# EAGLE design RedBoard_Plus (EAGLE 9.5.2)
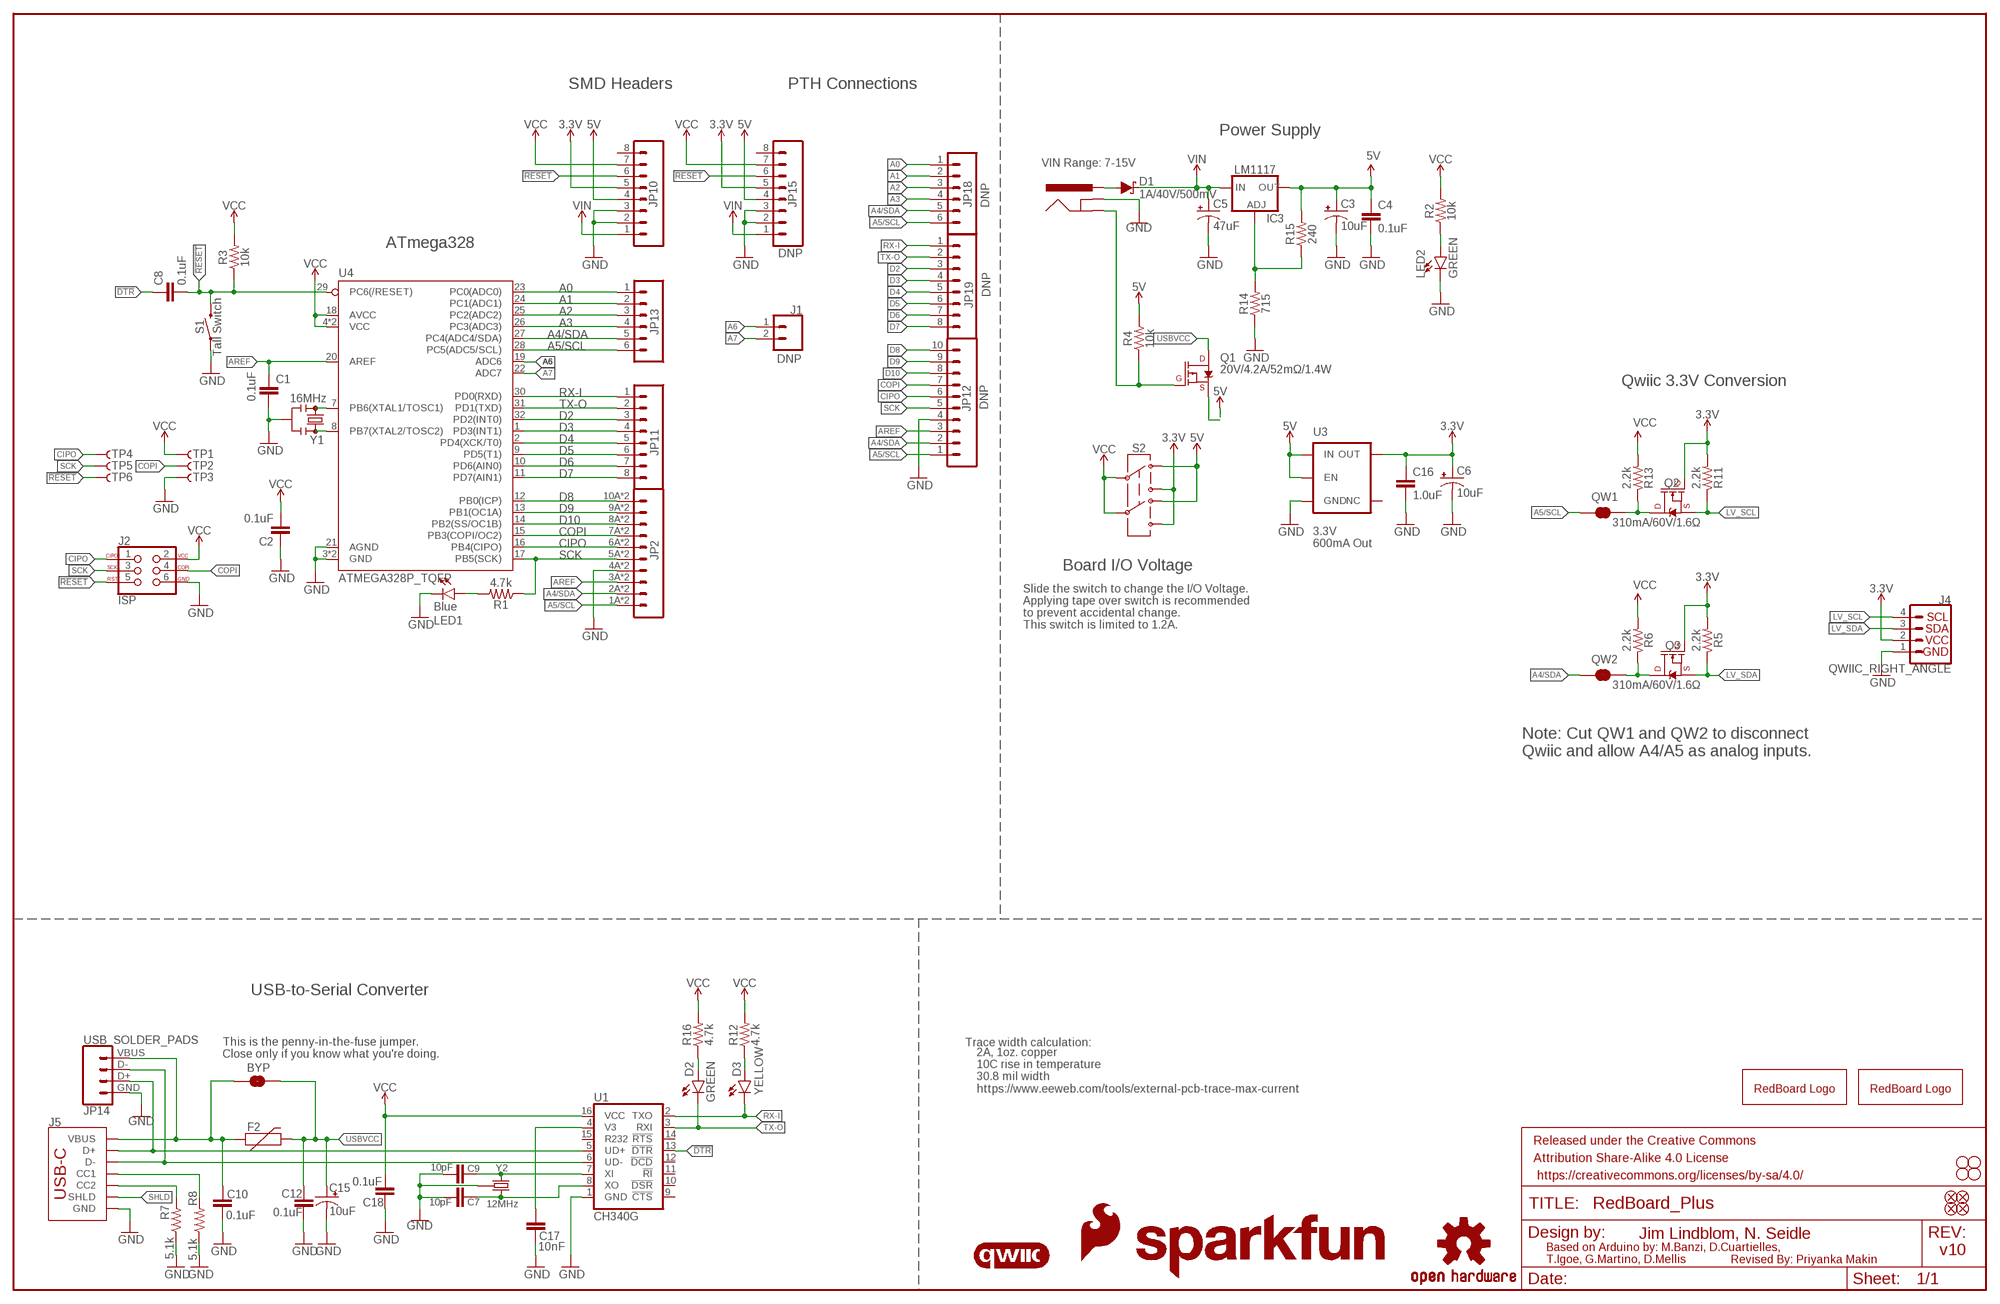
[diagram p0: schematic, sheet 1]

## Parts
BYP  JUMPER-SMT_2_NO_SILK  [SMT-JUMPER_2_NO_SILK]
C1  0.1uF  0.1UF-0603-25V-(+80/-20%)  [0603]
C2  0.1uF  0.1UF-0603-25V-(+80/-20%)  [0603]
C3  10uF  10UF-POLAR-EIA3216-16V-10%(TANT)  [EIA3216]
C4  0.1uF  0.1UF-0603-25V-(+80/-20%)  [0603]
C5  47uF  47UF-POLAR-PANASONIC_D-35V-20%  [PANASONIC_D]
C6  10uF  10UF-POLAR-EIA3216-16V-10%(TANT)  [EIA3216]
C7  10pF  10PF-0603-50V-5%  [0603]
C8  0.1uF  0.1UF-0603-25V-(+80/-20%)  [0603]
C9  10pF  10PF-0603-50V-5%  [0603]
C10  0.1uF  0.1UF-0603-25V-(+80/-20%)  [0603]
C12  0.1uF  0.1UF-0603-25V-(+80/-20%)  [0603]
C15  10uF  10UF-POLAR-EIA3216-16V-10%(TANT)  [EIA3216]
C16  1.0uF  1.0UF-0603-16V-10%  [0603]
C17  10nF  10NF-0603-50V-10%  [0603]
C18  0.1uF  0.1UF-0603-25V-(+80/-20%)  [0603]
D1  1A/40V/500mV  DIODE-SCHOTTKY-SS14  [SMA-DIODE]
D2  GREEN  LED-GREENLILYPAD  [LED-1206]
D3  YELLOW  LED-YELLOW_HIDDENSILK  [LED-1206-HIDDENSILK]
F2  6V/2A  PPTC_6V2A  [1210]
FD1  FIDUCIAL1X2  [FIDUCIAL-1X2]
FD2  FIDUCIAL1X2  [FIDUCIAL-1X2]
FRAME1  FRAME-LEDGER  [CREATIVE_COMMONS]
IC3  LM1117  V_REG_LM1117SOT223  [SOT223]
J1  DNP  CONN_021X02_NO_SILK  [1X02_NO_SILK]
J2  ISP  AVR_SPI_PROG_3X2SMD  [2X3_SMT_POSTS]
J3  5.5x2.1mm Barrel  POWER_JACKSMD  [POWER_JACK_SMD]
J4  QWIIC_RIGHT_ANGLE  QWIIC_CONNECTORJS-1MM  [JST04_1MM_RA]
J5  USB Female Type C Connector  USB_C_2-LAYER_PADS  [USB-C-16P-2LAYER-PADS]
JP1  SFE_LOGO_NAME.1_INCH  [SFE_LOGO_NAME_.1]
JP2  CONN_10SMD_COMBO-FEMALE  [1X10_SMD_COMBINED]
JP3  STAND-OFFTIGHT  [STAND-OFF-TIGHT]
JP4  STAND-OFFTIGHT  [STAND-OFF-TIGHT]
JP5  STAND-OFFTIGHT  [STAND-OFF-TIGHT]
JP6  STAND-OFFTIGHT  [STAND-OFF-TIGHT]
JP7  SFE_LOGO_FLAME.1_INCH  [SFE_LOGO_FLAME_.1]
JP8  FIDUCIAL1X2  [FIDUCIAL-1X2]
JP9  FIDUCIAL1X2  [FIDUCIAL-1X2]
JP10  CONN_08SMD-COMBO-FEMALE  [1X08_SMD_COMBINED]
JP11  JP11  CONN_08SMD-COMBO-FEMALE  [1X08_SMD_COMBINED]
JP12  DNP  CONN_10NO_SILK_PTH_FEMALE  [1X10_NO_SILK]
JP13  CONN_06SMD-STRAIGHT-COMBO-FEMALE  [1X06_SMD_STRAIGHT_COMBO]
JP14  USB_SOLDER_PADS  [USB-SOLDER-PADS]
JP15  DNP  CONN_08NO_SILK_DNP  [1X08_NO_SILK]
JP18  DNP  CONN_06NO_SILK_NO_POP  [1X06_NO_SILK]
JP19  DNP  CONN_08NO_SILK_DNP  [1X08_NO_SILK]
LED1  Blue  LED-BLUE_HIDDENSILK  [LED-1206-HIDDENSILK]
LED2  GREEN  LED-GREENLILYPAD  [LED-1206]
LOGO1  QWIIC_LOGO_5MM  [QWIIC_5MM]
Q1  20V/4.2A/52mΩ/1.4W  MOSFET_PCH-DMG2305UX-7  [SOT23-3]
Q2  310mA/60V/1.6Ω  MOSFET-NCH-2N7002PW  [SOT323]
Q3  310mA/60V/1.6Ω  MOSFET-NCH-2N7002PW  [SOT323]
QW1  JUMPER-SMT_2_NC_TRACE_SILK  [SMT-JUMPER_2_NC_TRACE_SILK]
QW2  JUMPER-SMT_2_NC_TRACE_SILK  [SMT-JUMPER_2_NC_TRACE_SILK]
R1  4.7k  4.7KOHM-0603-1/10W-1%  [0603]
R2  10k  10KOHM-0603-1/10W-1%  [0603]
R3  10k  10KOHM-0603-1/10W-1%  [0603]
R4  10k  10KOHM-0603-1/10W-1%  [0603]
R5  2.2k  2.2KOHM-0603-1/10W-1%  [0603]
R6  2.2k  2.2KOHM-0603-1/10W-1%  [0603]
R7  5.1k  5.1KOHM5.1KOHM-0603-1/10W-1%  [0603]
R8  5.1k  5.1KOHM5.1KOHM-0603-1/10W-1%  [0603]
R11  2.2k  2.2KOHM-0603-1/10W-1%  [0603]
R12  4.7k  4.7KOHM-0603-1/10W-1%  [0603]
R13  2.2k  2.2KOHM-0603-1/10W-1%  [0603]
R14  715  715OHM-0603-1/10W-1%  [0603]
R15  240  240OHM-0603-1/10W-1%  [0603]
R16  4.7k  4.7KOHM-0603-1/10W-1%  [0603]
S1  Tall Switch  MOMENTARY-SWITCH-SPST-SMD-5.2-TALL-REDUNDANT  [TACTILE_SWITCH_SMD_5.2MM]
S2  SWITCH-DPDT-SMD-AYZ0202  [SWITCH_DPDT_SMD_AYZ0202]
TP1  TP-3x5  TEST-POINT3X5  [PAD.03X.05]
TP2  TP-3x5  TEST-POINT3X5  [PAD.03X.05]
TP3  TP-3x5  TEST-POINT3X5  [PAD.03X.05]
TP4  TP-3x5  TEST-POINT3X5  [PAD.03X.05]
TP5  TP-3x5  TEST-POINT3X5  [PAD.03X.05]
TP6  TP-3x5  TEST-POINT3X5  [PAD.03X.05]
U1  CH340G  CH340GSMD  [SO016]
U3  3.3V  V_REG_AP2112K-3.3V  [SOT23-5]
U4  ATMEGA328P_TQFP  [TQFP32-08]
U$1  REDBOARD_LOGO  [REDBOARD_LOGO]
U$3  REDBOARD_LOGO  [REDBOARD_LOGO]
U$16  OSHW-LOGOS  [OSHW-LOGO-S]
Y1  16MHz  RESONATOR-16MHZSMD_3.2X1.3  [RESONATOR-SMD-3.2X1.3]
Y2  12MHz  CRYSTAL-GROUNDEDSMD-3.2X2.5  [CRYSTAL-SMD-3.2X2.5MM]

## Nets
3.3V [power]: C6.+ C16.1 J4.2 JP10.5 JP15.5 Q2.1(G) Q3.1(G) R5.2 R11.2 S2.1 S2.4 U3.5(OUT)
5V [power]: C3.+ C4.1 IC3.2(OUT) IC3.4(OUT) JP10.4 JP15.4 Q1.2(S) R4.2 R15.2 S2.3 S2.6 U3.1(IN) U3.3(EN)
!DTR!: C8.1 U1.13(!DTR)
!RESET: C8.2 J2.5 JP10.6 JP15.6 R3.1 S1.3 S1.4 TP6.P$1 U4.29(PC6(/RESET))
A0: JP13.1 JP18.1 U4.23(PC0(ADC0))
A1: JP13.2 JP18.2 U4.24(PC1(ADC1))
A2: JP13.3 JP18.3 U4.25(PC2(ADC2))
A3: JP13.4 JP18.4 U4.26(PC3(ADC3))
A4/SDA: JP2.2A JP2.2B JP12.2 JP13.5 JP18.5 QW2.1 U4.27(PC4(ADC4/SDA))
A5/SCL: JP2.1A JP2.1B JP12.1 JP13.6 JP18.6 QW1.1 U4.28(PC5(ADC5/SCL))
A6: J1.1 U4.19(ADC6)
A7: J1.2 U4.22(ADC7)
AREF: C1.1 JP2.3A JP2.3B JP12.3 U4.20(AREF)
CC1: J5.A5(CC1) R8.2
CC2: J5.B5(CC2) R7.2
CIPO: J2.1 JP2.6A JP2.6B JP12.6 TP4.P$1 U4.16(PB4(CIPO))
COPI: J2.4 JP2.7A JP2.7B JP12.7 TP2.P$1 U4.15(PB3(COPI/OC2))
D2: JP11.3 JP19.3 U4.32(PD2(INT0))
D3: JP11.4 JP19.4 U4.1(PD3(INT1))
D4: JP11.5 JP19.5 U4.2(PD4(XCK/T0))
D5: JP11.6 JP19.6 U4.9(PD5(T1))
D6: JP11.7 JP19.7 U4.10(PD6(AIN0))
D7: JP11.8 JP19.8 U4.11(PD7(AIN1))
D8: JP2.10A JP2.10B JP12.10 U4.12(PB0(ICP))
D9: JP2.9A JP2.9B JP12.9 U4.13(PB1(OC1A))
D10: JP2.8A JP2.8B JP12.8 U4.14(PB2(SS/OC1B))
D+: J5.A6(D+) J5.B6(D+) JP14.D+ U1.5(UD+)
D-: J5.A7(D-) J5.B7(D-) JP14.D- U1.6(UD-)
GND: C1.2 C2.1 C3.- C4.2 C5.- C6.- C7.2 C9.2 C10.2 C12.2 C15.- C16.2 C17.2 C18.2 J2.6 J3.GND(GNDBREAK) J4.1 J5.GND J5.GND2(GND) JP2.4A JP2.4B JP10.2 JP10.3 JP12.4 JP14.GND JP15.2 JP15.3 LED1.C LED2.C R7.1 R8.1 R14.1 S1.1 S1.2 TP3.P$1 U1.1(GND) U3.2(GND) U4.3(GND) U4.5(GND) U4.21(AGND) Y1.2 Y2.2(GND) Y2.4(GND)
INSERT: J3.P$4(GND) Q1.1(G) R4.1
LV_SCL: J4.4 Q2.2(S) R11.1
LV_SDA: J4.3 Q3.2(S) R5.1
N$1: LED1.A R1.2
N$2: LED2.A R2.1
N$3: U4.7(PB6(XTAL1/TOSC1)) Y1.1
N$4: U4.8(PB7(XTAL2/TOSC2)) Y1.3
N$5: D2.A R16.1
N$6: C17.1 U1.4(V3)
N$7: Q2.3(D) QW1.2 R13.1
N$8: C9.1 U1.7(XI) Y2.1
N$9: D3.A R12.1
N$10: C7.1 U1.8(XO) Y2.3
N$15: IC3.1(ADJ) R14.2 R15.1
N$45: Q3.3(D) QW2.2 R6.1
PWRIN [power]: D1.A J3.VIN0(PWR)
RX-I: D3.C JP11.1 JP19.1 U1.2(TXO) U4.30(PD0(RXD))
SCK: J2.3 JP2.5A JP2.5B JP12.5 R1.1 TP5.P$1 U4.17(PB5(SCK))
SHLD: J5.SHLD1(SHLD) J5.SHLD2(SHLD) J5.SHLD3(SHLD) J5.SHLD4(SHLD)
TX-O: D2.C JP11.2 JP19.2 U1.3(RXI) U4.31(PD1(TXD))
USBVCC [power]: BYP.2 C12.1 C15.+ F2.2 Q1.3(D)
VCC: C2.2 C18.1 J2.2 JP10.7 JP15.7 R2.2 R3.2 R6.2 R12.2 R13.2 R16.2 S2.2 S2.5 TP1.P$1 U1.16(VCC) U4.4(VCC) U4.6(VCC) U4.18(AVCC)
VIN [power]: C5.+ D1.C IC3.3(IN) JP10.1 JP15.1
VUSB [power]: BYP.1 C10.1 F2.1 J5.VBUS1(VBUS) J5.VBUS2(VBUS) JP14.VBUS
Unconnected: JP10.8 JP15.8 U1.9(!CTS) U1.10(!DSR) U1.11(!RI) U1.12(!DCD) U1.14(!RTS) U1.15(R232) U3.4(NC)

## Notes on the sheet
- SMD Headers | PTH Connections
- Power Supply
- VIN Range: 7-15V
- ATmega328
- Qwiic 3.3V Conversion
- 3.3V
  600mA Out
- Board I/O Voltage
- Slide the switch to change the I/O Voltage.
  Applying tape over switch is recommended
  to prevent accidental change.
- This switch is limited to 1.2A.
- Note: Cut QW1 and QW2 to disconnect 
  Qwiic and allow A4/A5 as analog inputs.
- USB-to-Serial Converter
- Trace width calculation:
- This is the penny-in-the-fuse jumper.
  Close only if you know what you're doing.
- 2A, 1oz. copper
  10C rise in temperature
  30.8 mil width
  https://www.eeweb.com/tools/external-pcb-trace-max-current
- Jim Lindblom, N. Seidle
- v10
- Based on Arduino by: M.Banzi, D.Cuartielles, 
  T.Igoe, G.Martino, D.Mellis
- Revised By: Priyanka Makin

## Library data of the parts
BYP = SparkFun-Jumpers:JUMPER-SMT_2_NO: Normally open jumper This jumper has two pads in close proximity to each other. Apply solder to close the connection. Round pads are easier to solder for beginners, but are a lot larger. SparkFun Product that uses the round pads: SparkFun EL Sequencer <https://www.sparkfun.com/products/12781>
C1 C2 C4 C8 C10 C12 C18 = SparkFun-Capacitors:0.1UF: 0.1µF ceramic capacitors A capacitor is a passive two-terminal electrical component used to store electrical energy temporarily in an electric field.; PROD_ID: CAP-00810
C3 C6 C15 = SparkFun-Capacitors:10UF-POLAR: 10.0µF polarized capacitors A capacitor is a passive two-terminal electrical component used to store electrical energy temporarily in an electric field.; PROD_ID: CAP-00811
C5 = SparkFun-Capacitors:47UF-POLAR: 47µF polarized capacitors A capacitor is a passive two-terminal electrical component used to store electrical energy temporarily in an electric field.; PROD_ID: CAP-08478
C7 C9 = SparkFun-Capacitors:10PF: 10pF ceramic capacitors A capacitor is a passive two-terminal electrical component used to store electrical energy temporarily in an electric field.; PROD_ID: CAP-11812
C16 = SparkFun-Capacitors:1.0UF: 1µF ceramic capacitors A capacitor is a passive two-terminal electrical component used to store electrical energy temporarily in an electric field.; PROD_ID: CAP-00868
C17 = SparkFun-Capacitors:10NF: 0.01uF/10nF/10,000pF ceramic capacitors A capacitor is a passive two-terminal electrical component used to store electrical energy temporarily in an electric field. CAP-09321; PROD_ID: CAP-00867
D1 = SparkFun-DiscreteSemi:DIODE-SCHOTTKY: Schottky diode A Schottky diode is a semiconductor diode which has a low forward voltage drop and a very fast switching action.; PROD_ID: DIO-08053
D2 LED2 = SparkFun-LED:LED-GREEN: Green SMD LED Used in manufacturing of various products at SparkFun Packages: 0603 - SMD 0603 package [Product Link] <http://www.futureelectronics.com/en/technologies/semiconductors/optoelectronics/leds/Pages/9894312-LTST-C190GKT.aspx?CrossPart=HSMG-C190&IM=0> LilyPad 1206 - SMD1206 LilyPad package [Product Link] <http://www.futureelectronics.com/en/Technologies/Product.aspx?ProductID=IN150NGHARVATEKCORPORATION2049943&IM=0> 1206 - SMD1206 package [Product Link] <http://www.futureelectronics.com/en/technologies/semiconductors/optoelectronics/leds/Pages/8315665-LTST-C150KGKT.aspx?IM=0> 1206 Bottom Mount -SMD 1206 Bottom Mount [Product Link] <http://www.digikey.com/product-detail/en/lite-on-inc/LTST-C230KGKT/160-1456-1-ND/386854> SparkFun Products: Pro Mini 328 -5V <https://www.sparkfun.com/products/821> RedBoard <https://www.sparkfun.com/products/12757> MP3 Trigger <https://www.sparkfun.com/products/13720> Makey Makey <https://www.sparkfun.com/products/11076>; PROD_ID: DIO-09910
D3 = SparkFun-LED:LED-YELLOW: Yellow SMD LED Used in manufacturing several products at SparkFun. Packages: 0603 - SMD 0603 package[Product Link] <http://www.kingbrightusa.com/product.asp?catalog_name=LED&product_id=APT1608SYCK> 0603 -SMART - SMART SMD 0603 package (more efficient/more expensive) [Product Link] <http://www.osram-os.com/osram_os/en/products/product-catalog/led-light-emitting-diodes/smartled-0603/ly-l29k/index.jsp> LilyPad - SMD1206 package[Product Datasheet] <https://www.sparkfun.com/datasheets/DevTools/LilyPad/Q150YUS4.pdf> SparkFun Products: Blynk Board <https://www.sparkfun.com/products/13794> IOIO-OTG <https://www.sparkfun.com/products/13613> XBee Explorer Serial <https://www.sparkfun.com/products/13225>; PROD_ID: DIO-09909
F2 = SparkFun-Fuses:PPTC: Resettable Fuse PPTC Resettable Fuse. Really a sort of resistor with a polymeric positive temperature coefficient whose resistance increases dramatically with an increase in temperature. When heated by the power passing through the resistance rises causing the current to be limited, protecting the circuit. This is achieved by the transition of the polymer from a crystalline to an amorphous state where the conductive carbon separates breaking the conductive pathways found in the cool crystalline structure. When a PPTC cools back down it resumes conducting letting the circuit turn back on. SparkFun Products: SparkFun RedBoard - Programmed with Arduino <https://www.sparkfun.com/products/12757> Pro Micro - 5V/16MHz <https://www.sparkfun.com/products/12640> Arduino Pro 328 - 5V/16MHz <https://www.sparkfun.com/products/10915> MP3 Trigger <https://www.sparkfun.com/products/13720>; PROD_ID: RES-14313
FD1 FD2 JP8 JP9 = SparkFun-Aesthetics:FIDUCIAL: Fiducial Alignment Points Point-of-reference for pick-and-place machines and other optical instruments.
FRAME1 = SparkFun-Aesthetics:FRAME-LEDGER: Schematic Frame - Ledger Standard 11x14 US Ledger frame
IC3 = SparkFun-IC-Power:V_REG_LM1117: Voltage Regulator LM1117 Standard adjustable voltage regulator but in SMD form. Spark Fun Electronics SKU : COM-00595; PROD_ID: VREG-08170
J1 = SparkFun-Connectors:CONN_02: Multi connection point. Often used as Generic Header-pin footprint for 0.1 inch spaced/style header connections On any of the 0.1 inch spaced packages, you can populate with these: Break Away Headers - Straight <https://www.sparkfun.com/products/116> (PRT-00116) Break Away Male Headers - Right Angle <https://www.sparkfun.com/products/553> (PRT-00553) Female Headers <https://www.sparkfun.com/products/115> (PRT-00115) Break Away Headers - Machine Pin <https://www.sparkfun.com/products/117> (PRT-00117) Break Away Female Headers - Swiss Machine Pin <https://www.sparkfun.com/products/743> (PRT-00743) For SCREWTERMINALS and SPRING TERMINALS visit here: Screw Terimnals on SparkFun.com <https://www.sparkfun.com/search/results?term=Screw+Terminals> (5mm/3.5mm/2.54mm spacing) This device is also useful as a general connection point to wire up your design to another part of your project. Our various solder wires solder well into these plated through hole pads. Hook-Up Wire - Assortment (Stranded, 22 AWG) <https://www.sparkfun.com/products/11375> (PRT-11375) Hook-Up Wire - Assortment (Solid Core, 22 AWG) <https://www.sparkfun.com/products/11367> (PRT-11367) View the entire wire category on our website here <https://www.sparkfun.com/categories/141> Special notes: Molex polarized connector foot print use with: PRT-08233 with associated crimp pins and housings. 2.54_SCREWTERM for use with PRT-10571. 3.5mm Screw Terminal footprints for PRT-08084 5mm Screw Terminal footprints for use with PRT-08432
J2 = SparkFun-Connectors:AVR_SPI_PROG_3X2: AVR ISP 6 Pin This is the reduced ISP connector for AVR programming. Common on Arduino. This footprint will take up less PCB space and can be used with a 10-pin to 6-pin adapter such as SKU: BOB-08508 **Special note about "TEST_POINT" package. The stop mask is on the top side, so if you want your programming test points to be on the bottom of your board, make sure to place this package on the bottom side of the board. This also ensure that the orientation to program from the bottom side will be correct. SparkFun Products: SparkFun ISP Pogo Adapter <https://www.sparkfun.com/products/11591> - NS Tiny AVR Programmer <https://www.sparkfun.com/products/11801> -PTH; PROD_ID: CONN-11415
J3 = SparkFun-Connectors:POWER_JACK: Power Jack Connector This is the standard 5.5mm barrel jack for power. The PTH is the most common, proven, reliable, footprint. The Slot footprint only works if the mill layer is transmitted to the PCB fab house so be warned. Here are the connectors we sell at SparkFun: DC Barrel Power Jack/Connector <https://www.sparkfun.com/products/119> (PRT-00119) DC Barrel Power Jack/Connector (SMD) <https://www.sparkfun.com/products/12748> (PRT-12748) DC Barrel Jack Adapter - Breadboard Compatible <https://www.sparkfun.com/products/10811> (PRT-10811) It is used on this SparkFun product (and many, many others): SparkFun RedBoard - Programmed with Arduino <https://www.sparkfun.com/products/12757> (DEV-12757) Also, if you need a mating power supply or connector, please check these out: Wall Adapter Power Supply - 9VDC 650mA <https://www.sparkfun.com/products/298> (TOL-00298) DC Barrel Jack Adapter - Male <https://www.sparkfun.com/products/10287> (PRT-10287); PROD_ID: CONN-08106; SF_ID: PRT-12748
J4 = SparkFun-Connectors:QWIIC_CONNECTOR: SparkFun I2C Standard Qwiic Connector An SMD 1mm pitch JST connector makes it easy and quick (get it? Qwiic?) to connect I2C devices to each other. The Qwiic system <http://www.sparkfun.com/qwiic> enables fast and solderless connection between popular platforms and various sensors and actuators. We carry 200mm <https://www.sparkfun.com/products/14204>, 100mm <https://www.sparkfun.com/products/14205>, 50mm <https://www.sparkfun.com/products/14206>, and breadboard friendly <https://www.sparkfun.com/products/14207> Qwiic cables. We also offer 10 pcs strips <https://www.sparkfun.com/products/14323> the SMD connectors.; PROD_ID: CONN-13694
J5 = SparkFun-Connectors:USB_C: USB Type C 16Pin Connector Super Speed pins not available on the 16-pin purely SMD connector so this part is best for USB 2.0 implementations. D1 and D2 are tied together enabling D+/- no matter which way the cable is plugged into the connector. The two channel configuration pins (CC1/2) are exposed. These are normally connected to ground via 5.1k resistors but can be reconfigured for high current/high power applications. **4-LAYER BOARD WARNING!!** If designing 4-layer board, make sure to select the variant _4-LAYER-ISOLATED. The linked footprint (USB-C-16-4LAYER-ISOLATED) includes some very necessary cutout polygons in the inner layers (2 and 15). This prevents the PTH mounting shield legs on the USB connector from electrically connecting any other polygons on the inner layers (usually VCC and GND).; PROD_ID: CONN-14122
JP1 = SparkFun-Aesthetics:SFE_LOGO_NAME: SparkFun Font Logo This is the SparkFun name logo. The logo on the schematic will always be the same size; the package variant is the height of the flame part of the logo (or the height the flame would be, if it were drawn). Default layer for the logo on the board is tSilk.
JP2 JP12 = SparkFun-Connectors:CONN_10: Multi connection point. Often used as Generic Header-pin footprint for 0.1 inch spaced/style header connections On any of the 0.1 inch spaced packages, you can populate with these: Break Away Headers - Straight <https://www.sparkfun.com/products/116> (PRT-00116) Break Away Male Headers - Right Angle <https://www.sparkfun.com/products/553> (PRT-00553) Female Headers <https://www.sparkfun.com/products/115> (PRT-00115) Break Away Headers - Machine Pin <https://www.sparkfun.com/products/117> (PRT-00117) Break Away Female Headers - Swiss Machine Pin <https://www.sparkfun.com/products/743> (PRT-00743) Arduino Stackable Header - 10 Pin <https://www.sparkfun.com/products/11376> (PRT-11376) For SCREWTERMINALS and SPRING TERMINALS visit here: Screw Terimnals on SparkFun.com <https://www.sparkfun.com/search/results?term=Screw+Terminals> (5mm/3.5mm/2.54mm spacing) This device is also useful as a general connection point to wire up your design to another part of your project. Our various solder wires solder well into these plated through hole pads. Hook-Up Wire - Assortment (Stranded, 22 AWG) <https://www.sparkfun.com/products/11375> (PRT-11375) Hook-Up Wire - Assortment (Solid Core, 22 AWG) <https://www.sparkfun.com/products/11367> (PRT-11367) View the entire wire category on our website here <https://www.sparkfun.com/categories/141> Special notes: Molex polarized connector foot print use with SKU : PRT-08231 with associated crimp pins and housings. 1MM SMD Version SKU: PRT-10208 NOTES ON THE VARIANTS LOCK and LOCK_LONGPADS... This footprint was designed to help hold the alignment of a through-hole component (i.e. 6-pin header) while soldering it into place. You may notice that each hole has been shifted either up or down by 0.005 of an inch from it's more standard position (which is a perfectly straight line). This slight alteration caused the pins (the squares in the middle) to touch the edges of the holes. Because they are alternating, it causes a "brace" to hold the component in place. 0.005 has proven to be the perfect amount of "off-center" position when using our standard breakaway headers. Although looks a little odd when you look at the bare footprint, once you have a header in there, the alteration is very hard to notice. Also,if you push a header all the way into place, it is covered up entirely on the bottom side.; PROD_ID: CONN-11219
JP3-JP6 = SparkFun-Hardware:STAND-OFF: Stand Off Drill holes for mechanically mounting via screws, standoffs, etc. Note: Use the keepout ring to avoid running the screw head into surrounding components. Variant Overviews STAND-OFF - Mechanical footprint for a #4 phillips button head screw. STAND-OFF-TIGHT - Mechanical footprint for a #4 phillips button head screw, Example SparkFun Products Screw - Phillips Head (1/4", 4-40, 10 pack) <https://www.sparkfun.com/products/10453> (PRT-10453) Screw - Phillips Head (1/2", 4-40, 10 pack) <https://www.sparkfun.com/products/10452> (PRT-10452) Screw - Phillips Head (3/4", 4-40, 10 pack) <https://www.sparkfun.com/products/10451> (PRT-10451) Screw - Phillips Head (1", 4-40, 10 pack) <https://www.sparkfun.com/products/10450> (PRT-10450)
JP7 = SparkFun-Aesthetics:SFE_LOGO_FLAME: SparkFun Flame Logo This is the SparkFun flame logo. The logo on the schematic will always be the same size; the package variant is the height of the flame. Default layer for the logo on the board is tSilk.
JP10 JP11 = SparkFun-Connectors:CONN_08: Multi connection point. Often used as Generic Header-pin footprint for 0.1 inch spaced/style header connections On any of the 0.1 inch spaced packages, you can populate with these: Break Away Headers - Straight <https://www.sparkfun.com/products/116> (PRT-00116) Break Away Male Headers - Right Angle <https://www.sparkfun.com/products/553> (PRT-00553) Female Headers <https://www.sparkfun.com/products/115> (PRT-00115) Break Away Headers - Machine Pin <https://www.sparkfun.com/products/117> (PRT-00117) Break Away Female Headers - Swiss Machine Pin <https://www.sparkfun.com/products/743> (PRT-00743) Arduino Stackable Header - 8 Pin <https://www.sparkfun.com/products/9279> (PRT-09279) For SCREWTERMINALS and SPRING TERMINALS visit here: Screw Terimnals on SparkFun.com <https://www.sparkfun.com/search/results?term=Screw+Terminals> (5mm/3.5mm/2.54mm spacing) This device is also useful as a general connection point to wire up your design to another part of your project. Our various solder wires solder well into these plated through hole pads. Hook-Up Wire - Assortment (Stranded, 22 AWG) <https://www.sparkfun.com/products/11375> (PRT-11375) Hook-Up Wire - Assortment (Solid Core, 22 AWG) <https://www.sparkfun.com/products/11367> (PRT-11367) View the entire wire category on our website here <https://www.sparkfun.com/categories/141> Special notes: Molex polarized connector foot print use with SKU : PRT-08231 with associated crimp pins and housings. 1MM SMD Version SKU: PRT-10208 NOTES ON THE VARIANTS LOCK and LOCK_LONGPADS... This footprint was designed to help hold the alignment of a through-hole component (i.e. 6-pin header) while soldering it into place. You may notice that each hole has been shifted either up or down by 0.005 of an inch from it's more standard position (which is a perfectly straight line). This slight alteration caused the pins (the squares in the middle) to touch the edges of the holes. Because they are alternating, it causes a "brace" to hold the component in place. 0.005 has proven to be the perfect amount of "off-center" position when using our standard breakaway headers. Although looks a little odd when you look at the bare footprint, once you have a header in there, the alteration is very hard to notice. Also,if you push a header all the way into place, it is covered up entirely on the bottom side.; PROD_ID: CONN-10204; SF_ID: PRT-11543
JP13 JP18 = SparkFun-Connectors:CONN_06: Multi connection point. Often used as Generic Header-pin footprint for 0.1 inch spaced/style header connections On any of the 0.1 inch spaced packages, you can populate with these: Break Away Headers - Straight <https://www.sparkfun.com/products/116> (PRT-00116) Break Away Male Headers - Right Angle <https://www.sparkfun.com/products/553> (PRT-00553) Female Headers <https://www.sparkfun.com/products/115> (PRT-00115) Break Away Headers - Machine Pin <https://www.sparkfun.com/products/117> (PRT-00117) Break Away Female Headers - Swiss Machine Pin <https://www.sparkfun.com/products/743> (PRT-00743) Arduino Stackable Header - 6 Pin <https://www.sparkfun.com/products/9280> (PRT-09280) For SCREWTERMINALS and SPRING TERMINALS visit here: Screw Terimnals on SparkFun.com <https://www.sparkfun.com/search/results?term=Screw+Terminals> (5mm/3.5mm/2.54mm spacing) This device is also useful as a general connection point to wire up your design to another part of your project. Our various solder wires solder well into these plated through hole pads. Hook-Up Wire - Assortment (Stranded, 22 AWG) <https://www.sparkfun.com/products/11375> (PRT-11375) Hook-Up Wire - Assortment (Solid Core, 22 AWG) <https://www.sparkfun.com/products/11367> (PRT-11367) View the entire wire category on our website here <https://www.sparkfun.com/categories/141>; PROD_ID: CONN-10203
JP14 = SparkFun-Connectors:USB_SOLDER_PADS: Solder pad access to USB pins. Helpful to expose on PCBs so user can attach external USB connector if necessary.
JP15 = SparkFun-Connectors:CONN_08: Multi connection point. Often used as Generic Header-pin footprint for 0.1 inch spaced/style header connections On any of the 0.1 inch spaced packages, you can populate with these: Break Away Headers - Straight <https://www.sparkfun.com/products/116> (PRT-00116) Break Away Male Headers - Right Angle <https://www.sparkfun.com/products/553> (PRT-00553) Female Headers <https://www.sparkfun.com/products/115> (PRT-00115) Break Away Headers - Machine Pin <https://www.sparkfun.com/products/117> (PRT-00117) Break Away Female Headers - Swiss Machine Pin <https://www.sparkfun.com/products/743> (PRT-00743) Arduino Stackable Header - 8 Pin <https://www.sparkfun.com/products/9279> (PRT-09279) For SCREWTERMINALS and SPRING TERMINALS visit here: Screw Terimnals on SparkFun.com <https://www.sparkfun.com/search/results?term=Screw+Terminals> (5mm/3.5mm/2.54mm spacing) This device is also useful as a general connection point to wire up your design to another part of your project. Our various solder wires solder well into these plated through hole pads. Hook-Up Wire - Assortment (Stranded, 22 AWG) <https://www.sparkfun.com/products/11375> (PRT-11375) Hook-Up Wire - Assortment (Solid Core, 22 AWG) <https://www.sparkfun.com/products/11367> (PRT-11367) View the entire wire category on our website here <https://www.sparkfun.com/categories/141> Special notes: Molex polarized connector foot print use with SKU : PRT-08231 with associated crimp pins and housings. 1MM SMD Version SKU: PRT-10208 NOTES ON THE VARIANTS LOCK and LOCK_LONGPADS... This footprint was designed to help hold the alignment of a through-hole component (i.e. 6-pin header) while soldering it into place. You may notice that each hole has been shifted either up or down by 0.005 of an inch from it's more standard position (which is a perfectly straight line). This slight alteration caused the pins (the squares in the middle) to touch the edges of the holes. Because they are alternating, it causes a "brace" to hold the component in place. 0.005 has proven to be the perfect amount of "off-center" position when using our standard breakaway headers. Although looks a little odd when you look at the bare footprint, once you have a header in there, the alteration is very hard to notice. Also,if you push a header all the way into place, it is covered up entirely on the bottom side.; PROD_ID: CONN-10204
JP19 = SparkFun-Connectors:CONN_08: Multi connection point. Often used as Generic Header-pin footprint for 0.1 inch spaced/style header connections On any of the 0.1 inch spaced packages, you can populate with these: Break Away Headers - Straight <https://www.sparkfun.com/products/116> (PRT-00116) Break Away Male Headers - Right Angle <https://www.sparkfun.com/products/553> (PRT-00553) Female Headers <https://www.sparkfun.com/products/115> (PRT-00115) Break Away Headers - Machine Pin <https://www.sparkfun.com/products/117> (PRT-00117) Break Away Female Headers - Swiss Machine Pin <https://www.sparkfun.com/products/743> (PRT-00743) Arduino Stackable Header - 8 Pin <https://www.sparkfun.com/products/9279> (PRT-09279) For SCREWTERMINALS and SPRING TERMINALS visit here: Screw Terimnals on SparkFun.com <https://www.sparkfun.com/search/results?term=Screw+Terminals> (5mm/3.5mm/2.54mm spacing) This device is also useful as a general connection point to wire up your design to another part of your project. Our various solder wires solder well into these plated through hole pads. Hook-Up Wire - Assortment (Stranded, 22 AWG) <https://www.sparkfun.com/products/11375> (PRT-11375) Hook-Up Wire - Assortment (Solid Core, 22 AWG) <https://www.sparkfun.com/products/11367> (PRT-11367) View the entire wire category on our website here <https://www.sparkfun.com/categories/141> Special notes: Molex polarized connector foot print use with SKU : PRT-08231 with associated crimp pins and housings. 1MM SMD Version SKU: PRT-10208 NOTES ON THE VARIANTS LOCK and LOCK_LONGPADS... This footprint was designed to help hold the alignment of a through-hole component (i.e. 6-pin header) while soldering it into place. You may notice that each hole has been shifted either up or down by 0.005 of an inch from it's more standard position (which is a perfectly straight line). This slight alteration caused the pins (the squares in the middle) to touch the edges of the holes. Because they are alternating, it causes a "brace" to hold the component in place. 0.005 has proven to be the perfect amount of "off-center" position when using our standard breakaway headers. Although looks a little odd when you look at the bare footprint, once you have a header in there, the alteration is very hard to notice. Also,if you push a header all the way into place, it is covered up entirely on the bottom side.
LED1 = SparkFun-LED:LED-BLUE: Blue SMD LED Used in manufacturing of various products at SparkFun Packages: 0603 - SMD 0603 package [Product Link] <http://www.digikey.com/product-detail/en/SMLE12BC7TT86/511-1589-2-ND/1641808> 1206 - SMD1206 package [Product Link] <http://www.digikey.com/product-detail/en/lite-on-inc/LTST-C150TBKT/160-1643-1-ND/573584> SparkFun Products: ESP8266 Thing-Dev Board <https://www.sparkfun.com/products/13711> RedBoard <https://www.sparkfun.com/products/12757>; PROD_ID: DIO-09911
LOGO1 = SparkFun-Aesthetics:QWIIC_LOGO: Qwiic Logos for placement on schematic and PCB. The 5.5mm silk logo is best for placing next to Qwiic connector.
Q1 = SparkFun-DiscreteSemi:MOSFET_PCH: P-channel MOSFETs Voltage controlled devices that allow control of high current outputs. SparkFun Products: SparkFun ESP32 Thing <https://www.sparkfun.com/products/13907> SparkFun ESP8266 Thing <https://www.sparkfun.com/products/13231> SparkFun Pi Servo HAT V2 <https://www.sparkfun.com/products/15316> DMG2305UX-7 (20V/4.2A/SOT23-3); PROD_ID: TRANS-14388
Q2 Q3 = SparkFun-DiscreteSemi:MOSFET-NCH: N-channel MOSFETs Voltage controlled devices that allow control of high current outputs. SparkFun Products: SparkFun OpenScale <https://www.sparkfun.com/products/13261> SparkFun Digital Sandbox <https://www.sparkfun.com/products/12651> SparkFun Monster Moto Shield <https://www.sparkfun.com/products/10182> SparkFun MOSFET Power Controller <https://www.sparkfun.com/products/11214>; PROD_ID: TRANS-11151
QW1 QW2 = SparkFun-Jumpers:JUMPER-SMT_2_NC_TRACE: Normally closed trace jumper This jumper has a trace between two pads so it's normally closed (NC). Use a razor knife to open the connection. For best results follow the IPC guidelines for cutting traces: Cutout at least 0.063 mm (0.005 in). Remove all loose material to clean up the cut area. Seal the cut with an approved epoxy. Reapply solder to reclose the connection.
R1 R12 R16 = SparkFun-Resistors:4.7KOHM: 4.7kΩ resistor A resistor is a passive two-terminal electrical component that implements electrical resistance as a circuit element. Resistors act to reduce current flow, and, at the same time, act to lower voltage levels within circuits. - Wikipedia; PROD_ID: RES-07857
R2-R4 = SparkFun-Resistors:10KOHM: 10kΩ resistor A resistor is a passive two-terminal electrical component that implements electrical resistance as a circuit element. Resistors act to reduce current flow, and, at the same time, act to lower voltage levels within circuits. - Wikipedia; PROD_ID: RES-00824
R5 R6 R11 R13 = SparkFun-Resistors:2.2KOHM: 2.2kΩ resistor A resistor is a passive two-terminal electrical component that implements electrical resistance as a circuit element. Resistors act to reduce current flow, and, at the same time, act to lower voltage levels within circuits. - Wikipedia; PROD_ID: RES-08272
R7 R8 = SparkFun-Resistors:5.1KOHM; PROD_ID: RES-12083
R14 = SparkFun-Resistors:715OHM: 715Ω resistor A resistor is a passive two-terminal electrical component that implements electrical resistance as a circuit element. Resistors act to reduce current flow, and, at the same time, act to lower voltage levels within circuits. - Wikipedia; PROD_ID: RES-07850
R15 = SparkFun-Resistors:240OHM: 240Ω resistor A resistor is a passive two-terminal electrical component that implements electrical resistance as a circuit element. Resistors act to reduce current flow, and, at the same time, act to lower voltage levels within circuits. - Wikipedia; PROD_ID: RES-07849
S1 = SparkFun-Switches:MOMENTARY-SWITCH-SPST: Momentary Switch (Pushbutton) - SPST Normally-open (NO) SPST momentary switches (buttons, pushbuttons). Variants PTH-12MM - 12mm square, through-hole Momentary Pushbutton Switch - 12mm Square <https://www.sparkfun.com/products/9190> (COM-09190) PTH-6.0MM, PTH-6.0MM-KIT - 6.0mm square, through-hole Mini Pushbutton Switch <https://www.sparkfun.com/products/97> (COM-00097) KIT package intended for soldering kit's - only one side of pads' copper is exposed. PTH-RIGHT-ANGLE-KIT - Right-angle, through-hole Right Angle Tactile Button <https://www.sparkfun.com/products/10791> - Used on SparkFun BigTime Watch Kit <https://www.sparkfun.com/products/11734> SMD-12MM - 12mm square, surface-mount Tactile Button - SMD (12mm) <https://www.sparkfun.com/products/12993> (COM-12993) Used on SparkFun PicoBoard <https://www.sparkfun.com/products/11888> SMD-4.5MM - 4.5mm Square Trackball Switch Used on SparkFun Blackberry Trackballer Breakout <https://www.sparkfun.com/products/13169> SMD-4.6MMX2.8MM - 4.60mm x 2.80mm, surface mount Used on SparkFun Pro Micro - RP2040 <https://www.sparkfun.com/products/17717> SMD-5.2MM, SMD-5.2-REDUNDANT - 5.2mm square, surface-mount Mini Pushbutton Switch - SMD <https://www.sparkfun.com/products/8720> (COM-08720) Used on Arduino Pro Mini <https://www.sparkfun.com/products/11114> REDUNDANT package connects both switch circuits together SMD-6.0X3.5MM - 6.0 x 3.5mm, surface mount Momentary Reset Switch SMD <https://www.sparkfun.com/products/8229> (COM-08229) SMD-6.2MM-TALL - 6.2mm square, surface mount Tactile Button - SMD (6mm) <https://www.sparkfun.com/products/12992> Used on SparkFun Digital Sandbox <https://www.sparkfun.com/products/12651> SMD-RIGHT-ANGLE - Right-angle, surface mount Used on SparkFun Block for Intel® Edison - Arduino <https://www.sparkfun.com/products/13036>; PROD_ID: SWCH-14139
S2 = SparkFun-Switches:SWITCH-DPDT: Double-Pole, Double-Throw (DPDT) Switch Double-pole, double-throw switches. Variant Overview PTH-GPI-152-3013 Used on SparkFun Geiger Counter <https://www.sparkfun.com/products/11345> SMD-AY0202 Surface Mount DPDT Switch <https://www.sparkfun.com/products/597> (COM-00597) Used on e.g. LilyPad Arduino USB - ATmega32U4 Board <https://www.sparkfun.com/products/12049>; PROD_ID: SWCH-08179; SF_SKU: COM-00597
TP1-TP6 = SparkFun-Connectors:TEST-POINT: SparkFun Test Points Bare copper test points for troubleshooting or In-Circuit-Testing. These are used by our Production team for verifying production board runs using pogo-pins on test beds. SparkFun Products: SparkFun LSM9DS1 Breakout <https://www.sparkfun.com/products/13284> SparkFun PSOC <https://www.sparkfun.com/products/13714> SparkFun Load Cell Amplifier <https://www.sparkfun.com/products/13879>
U1 = SparkFun-IC-Comms:CH340G: A simple USB 2.0 to Serial IC.; PROD_ID: IC-13498
U3 = SparkFun-IC-Power:V_REG_AP2112: AP2112 - 600mA CMOS LDO Regulator w/ Enable The AP2112 is CMOS process low dropout linear regulator with enable function, the regulator delivers a guaranteed 600mA (min.) continuous load current. Features Output Voltage Accuracy: ±1.5% Output Current: 600mA (Min.) Foldback Short Current Protection: 50mA Enable Function to Turn ON/OFF VOUT Low Dropout Voltage (3.3V): 250mV (Typ.) @IOUT=600mA Excellent Load Regulation: 0.2%/A (Typ.) Excellent Line Regulation: 0.02%/V (Typ.) Low Quiescent Current: 55μA (Typ.) Low Standby Current: 0.01μA (Typ.) Low Output Noise: 50μVRMS PSRR: 100Hz -65dB, 1kHz -65dB OTSD Protection Stable with 1.0μF Flexible Cap: Ceramic, Tantalum and Aluminum Electrolytic Operation Temperature Range: -40°C to 85°C ESD: MM 400V, HBM 4000V; PROD_ID: VREG-12457
U4 = SparkFun-IC-Microcontroller:ATMEGA328P_TQFP: Popular 328P in QFP Storefront component: ATmega328 - TQFP <https://www.sparkfun.com/products/13448> (COM-13448) Datasheet <http://www.sparkfun.com/datasheets/Components/SMD/ATMega328.pdf> SparkFun Products SparkFun RedBoard - Programmed with Arduino <https://www.sparkfun.com/products/12757> (DEV-12757) Arduino Pro Mini 328 - 5V/16MHz <https://www.sparkfun.com/products/11113> (DEV-11113) Arduino Pro Mini 328 - 3.3V/8MHz <https://www.sparkfun.com/products/11114> (DEV-11114) SparkFun OpenLog <https://www.sparkfun.com/products/13712> (DEV-13712) SparkFun MicroView - OLED Arduino Module <https://www.sparkfun.com/products/12923> (DEV-12923) SparkFun Digital Sandbox <https://www.sparkfun.com/products/12651> (DEV-12651) SparkFun PicoBoard <https://www.sparkfun.com/products/11888> (WIG-11888) Arduino Fio <https://www.sparkfun.com/products/10116> (DEV-10116) LilyPad Arduino 328 Main Board <https://www.sparkfun.com/products/13342> (DEV-13342) SparkFun RedStick <https://www.sparkfun.com/products/13741> (DEV-13741) LilyPad MP3 <https://www.sparkfun.com/products/11013> (DEV-11013) LilyPad Arduino SimpleSnap <https://www.sparkfun.com/products/10941> (DEV-10941) SparkFun Stepoko <https://www.sparkfun.com/products/13899> (ROB-13899) SparkFun Geiger Counter <https://www.sparkfun.com/products/11345> (SEN-11345) SparkFun EL Sequencer <https://www.sparkfun.com/products/12781> (COM-12781) Arduino Pro 328 - 5V/16MHz <https://www.sparkfun.com/products/10915> (DEV-10915) CryptoCape <https://www.sparkfun.com/products/12773> (DEV-12773) SparkFun IR Thermometer Evaluation Board - MLX90614 <https://www.sparkfun.com/products/10740> (SEN-10740) SparkFun RedBot Mainboard <https://www.sparkfun.com/products/12097> (ROB-12097) Arduino Pro 328 - 3.3V/8MHz <https://www.sparkfun.com/products/10914> (DEV-10914) SparkFun Block for Intel® Edison - Arduino <https://www.sparkfun.com/products/13036> (DEV-13036) SparkFun Simon Says - Surface Mount Soldering Kit <https://www.sparkfun.com/products/10935> (KIT-10935) SparkFun 7-Segment Serial Display - Red <https://www.sparkfun.com/products/11441> (COM-11441) SparkFun 7-Segment Serial Display - White <https://www.sparkfun.com/products/11629> (COM-11629) SparkFun 7-Segment Serial Display - Yellow <https://www.sparkfun.com/products/11443> (COM-11443) SparkFun 7-Segment Serial Display - Kelly Green <https://www.sparkfun.com/products/11440> (COM-11440) SparkFun 7-Segment Serial Display - Blue <https://www.sparkfun.com/products/11442> (COM-11442) SparkFun OpenSegment Serial Display - 20mm (Blue) <https://www.sparkfun.com/products/11647> (COM-11647) SparkFun OpenSegment Serial Display - 20mm (Green) <https://www.sparkfun.com/products/11646> (COM-11646) SparkFun OpenSegment Serial Display - 20mm (White) <https://www.sparkfun.com/products/11648> (COM-11648) SparkFun OpenSegment Serial Display - 20mm (Red) <https://www.sparkfun.com/products/11644> (COM-11644) SparkFun OpenSegment Serial Display - 20mm (Yellow) <https://www.sparkfun.com/products/11645> (COM-11645) SparkFun OpenSegment Shield <https://www.sparkfun.com/products/13190> (DEV-13190); PROD_ID: IC-09069
U$1 U$3 = SparkFun-Aesthetics:REDBOARD_LOGO
U$16 = SparkFun-Aesthetics:OSHW-LOGO: Open-Source Hardware (OSHW) Logo This logo indicates the piece of hardware it is found on incorporates a OSHW license and/or adheres to the definition of open source hardware found here: http://freedomdefined.org/OSHW
Y1 = SparkFun-Clocks:RESONATOR-16MHZ: 16MHz Resonator Digikey Example <http://www.digikey.com/product-detail/en/murata-electronics-north-america/CSTCE16M0V53-R0/490-1198-1-ND/584635> Frequency: 16MHz Frequency Stability: ±0.3% Frequency Tolerance: ±0.5% Capacitance: 15pF SparkFun Products SparkFun OpenLog <https://www.sparkfun.com/products/13712> SparkFun MicroView - OLED Arduino Module <https://www.sparkfun.com/products/12923>; PROD_ID: XTAL-08900
Y2 = SparkFun-Clocks:CRYSTAL-GROUNDED: Crystals w/ Ground Pin (Generic) These are passive quartz crystals, which can be used as a clock source for a microcontroller. Crystal's are usually two-terminal devices. A third terminal may be optionally connected to ground, as recommended by the manufaturer.; PROD_ID: XTAL-13518

## Net classes
0 default: width 0 mm, drill 0 mm
1 power: width 0.762 mm

## Board
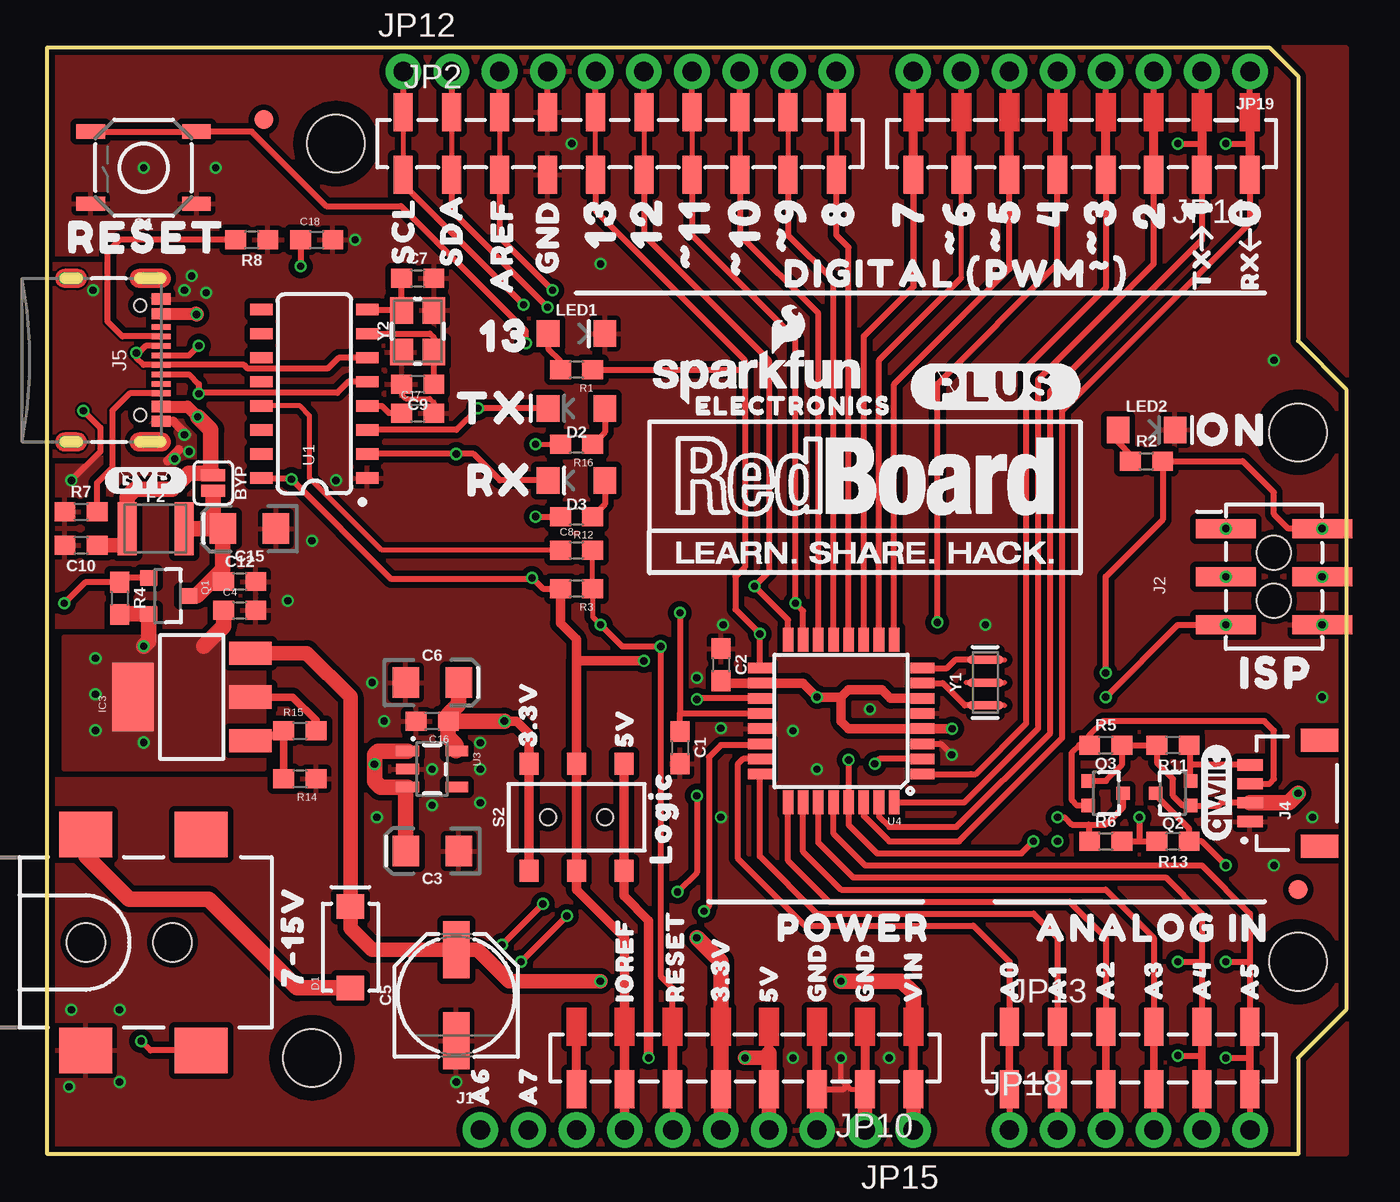
[diagram p1: board, top side]
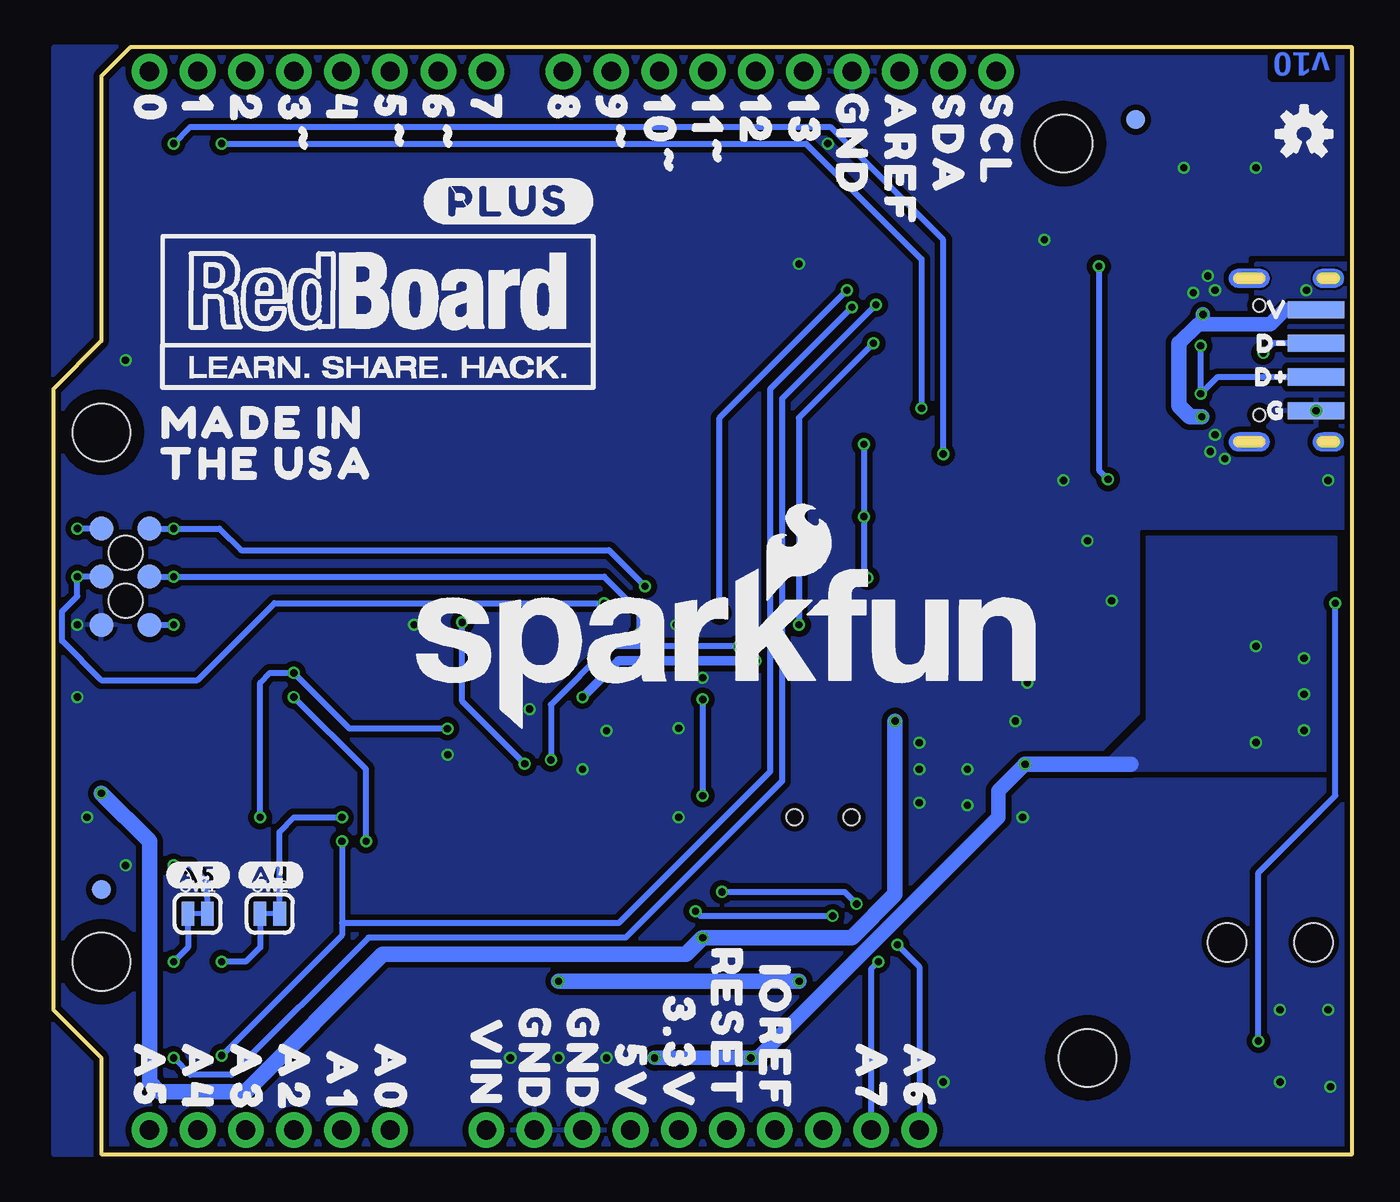
[diagram p2: board, bottom side, seen from below]

Size 68.58 x 58.42 mm. Coordinates in mm from the lower left corner, seen from the top.
Outline: 0,58.42 64.52,58.42 66.04,56.9 66.04,42.93 68.58,40.39 68.58,7.62 66.04,5.08 66.04,0 0,0 0,58.42
Copper layers (1*16): Top 0.035mm / dielectric 1.5mm / Bottom 0.035mm
Design rules "SparkFun-2-Layer-Minimum-JLCPCB": minimum track width 5mil, minimum drill 0.3mm, track to track 5mil, track to pad 5mil, pad to pad 5mil, via to via 5mil, smd to smd 5mil, copper to edge 7mil, drill to drill 7mil, minimum pad ring 5mil, minimum via ring 5mil, stop-mask expansion 2.5mil, vias tented up to drill 25mil, thermal gap 10mil
vRestrict: area 0.6,22.4 to 2,30.6; area 5.7,23.1 to 7.4,30.6; area 47.9,10.8 to 48.5,11.3; area 50.4,10.7 to 50.9,11.6; area 11.3,29.3 to 12.7,31.6; area 0.3,13 to 9.4,25

### Footprints (pad centres in the part's own frame; a part is rotated, then mirrored left to right if it is on the bottom)
SMT-JUMPER_2_NO_SILK = smd 0.635 x 1.27: 1 -0.406,0; 2 0.406,0
0603 = smd 1.1 x 1: 1 -0.85,0; 2 0.85,0
EIA3216 = smd 1.4 x 1.6: + 1.4,0; - -1.4,0
PANASONIC_D = smd 3 x 1.4: + 2.4,0; - -2.4,0
SMA-DIODE = smd 1.27 x 1.47: A -2.15,0; C 2.15,0
LED-1206 = smd 1.2 x 1.4: A -1.5,0; C 1.5,0
LED-1206-HIDDENSILK = smd 1.2 x 1.4: A -1.5,0; C 1.5,0
1210 = smd 1 x 2.8: 1 -1.5,0; 2 1.5,0
FIDUCIAL-1X2 = smd 1 x 1: 1 0,0
SOT223 = smd 1.219 x 2.235: 1 -2.311,-3.099; 2 0,-3.099; 3 2.311,-3.099 | smd 3.6 x 2.2: 4 0,3.099
1X02_NO_SILK = drill 1.016 pad 1.88: 1 0,0; 2 2.54,0
2X3_SMT_POSTS = smd 1 x 3.17: 1 -2.54,-2.54; 2 -2.54,2.54; 3 0,-2.54; 4 0,2.54; 5 2.54,-2.54; 6 2.54,2.54 | hole 1.8: -1.27,0; 1.27,0
POWER_JACK_SMD = smd 2.8 x 2.4: GND 0,-5.7; P$4 6.1,-5.7; VIN0 0,5.7; VIN1 6.1,5.7 | hole 2.032: 0,0; 4.572,0
JST04_1MM_RA = smd 0.6 x 1.35: 1 -1.5,0; 2 -0.5,0; 3 0.5,0; 4 1.5,0 | smd 1.2 x 2: NC1 2.8,-3.675; NC2 -2.8,-3.675
USB-C-16P-2LAYER-PADS = smd 0.3 x 1: A5 -1.25,-0.34; A6 -0.25,-0.34; A7 0.25,-0.34; A8 1.25,-0.34; B5 1.75,-0.34; B6 0.75,-0.34; B7 -0.75,-0.34; B8 -1.75,-0.34 | smd 0.6 x 1: GND -3.225,-0.34; GND2 3.225,-0.34; VBUS1 -2.45,-0.34; VBUS2 2.45,-0.34 | drill 0.4 pad 0.6 long: SHLD1 -4.318,-0.915; SHLD2 4.318,-0.915; SHLD3 -4.318,-5.095; SHLD4 4.318,-5.095 | hole 0.65: -2.89,-1.445; 2.89,-1.445
1X10_SMD_COMBINED = smd 1 x 2: 1A 0,1.65; 1B 0,-1.65; 2A 2.54,1.65; 2B 2.54,-1.65; 3A 5.08,1.65; 3B 5.08,-1.65; 4A 7.62,1.65; 4B 7.62,-1.65; 5A 10.16,1.65; 5B 10.16,-1.65; 6A 12.7,1.65; 6B 12.7,-1.65; 7A 15.24,1.65; 7B 15.24,-1.65; 8A 17.78,1.65; 8B 17.78,-1.65; 9A 20.32,1.65; 9B 20.32,-1.65; 10A 22.86,1.65; 10B 22.86,-1.65
STAND-OFF-TIGHT = hole 3.048: 0,0
1X08_SMD_COMBINED = smd 1 x 2: 1 0,1.65; 2 2.54,1.65; 3 5.08,1.65; 4 7.62,1.652; 5 10.16,1.65; 6 12.7,1.652; 7 15.24,1.65; 8 17.78,1.652
1X10_NO_SILK = drill 1.016 pad 1.88: 1 0,0; 2 2.54,0; 3 5.08,0; 4 7.62,0; 5 10.16,0; 6 12.7,0; 7 15.24,0; 8 17.78,0; 9 20.32,0; 10 22.86,0
1X06_SMD_STRAIGHT_COMBO = smd 1 x 2: 1 0,-1.65; 1-2 0,1.65; 2 2.54,1.65; 2-2 2.54,-1.65; 3 5.08,-1.65; 3-2 5.08,1.65; 4 7.62,1.65; 4-2 7.62,-1.65; 5 10.16,-1.65; 5-2 10.16,1.65; 6 12.7,1.65; 6-2 12.7,-1.65
USB-SOLDER-PADS = smd 3 x 0.9: D+ 0,-0.889; D- 0,0.889; GND 0,-2.667; VBUS 0,2.667
1X08_NO_SILK = drill 1.016 pad 1.88: 1 0,0; 2 2.54,0; 3 5.08,0; 4 7.62,0; 5 10.16,0; 6 12.7,0; 7 15.24,0; 8 17.78,0
1X06_NO_SILK = drill 1.016 pad 1.88: 1 0,0; 2 2.54,0; 3 5.08,0; 4 7.62,0; 5 10.16,0; 6 12.7,0
SOT23-3 = smd 0.8 x 0.9: 1 -0.95,-1; 2 0.95,-1; 3 0,1.1
SOT323 = smd 0.7 x 0.7: 1 -0.65,-0.925; 2 0.65,-0.925; 3 0,0.925
SMT-JUMPER_2_NC_TRACE_SILK = smd 0.66 x 1.27: 1 -0.521,0; 2 0.521,0
TACTILE_SWITCH_SMD_5.2MM = smd 1.524 x 0.762: 1 -2.794,1.905; 2 2.794,1.905; 3 -2.794,-1.905; 4 2.794,-1.905
SWITCH_DPDT_SMD_AYZ0202 = smd 1 x 1.15: 1 -2.5,2.825; 2 0,2.825; 3 2.5,2.825; 4 -2.5,-2.825; 5 0,-2.825; 6 2.5,-2.825 | hole 0.85: 1.5,0; -1.5,0
PAD.03X.05 = smd 1.27 x 1.27: P$1 0,0
SO016 = smd 0.6 x 1.2: 1 -4.445,-2.8; 2 -3.175,-2.8; 3 -1.905,-2.8; 4 -0.635,-2.8; 5 0.635,-2.8; 6 1.905,-2.8; 7 3.175,-2.8; 8 4.445,-2.8; 9 4.445,2.8; 10 3.175,2.8; 11 1.905,2.8; 12 0.635,2.8; 13 -0.635,2.8; 14 -1.905,2.8; 15 -3.175,2.8; 16 -4.445,2.8
SOT23-5 = smd 0.55 x 1.2: 1 -0.95,-1.3; 2 0,-1.3; 3 0.95,-1.3; 4 0.95,1.3; 5 -0.95,1.3
TQFP32-08 = smd 1.27 x 0.559: 1 -4.293,2.8; 2 -4.293,2; 3 -4.293,1.2; 4 -4.293,0.4; 5 -4.293,-0.4; 6 -4.293,-1.2; 7 -4.293,-2; 8 -4.293,-2.8; 17 4.293,-2.8; 18 4.293,-2; 19 4.293,-1.2; 20 4.293,-0.4; 21 4.293,0.4; 22 4.293,1.2; 23 4.293,2; 24 4.293,2.8 | smd 0.559 x 1.27: 9 -2.8,-4.293; 10 -2,-4.293; 11 -1.2,-4.293; 12 -0.4,-4.293; 13 0.4,-4.293; 14 1.2,-4.293; 15 2,-4.293; 16 2.8,-4.293; 25 2.8,4.293; 26 2,4.293; 27 1.2,4.293; 28 0.4,4.293; 29 -0.4,4.293; 30 -1.2,4.293; 31 -2,4.293; 32 -2.8,4.293
RESONATOR-SMD-3.2X1.3 = smd 0.45 x 1.905: 1 -1.2,0; 2 0,0; 3 1.2,0
CRYSTAL-SMD-3.2X2.5MM = smd 1.4 x 1.2: 1 -1.1,-0.85; 2 1.1,-0.85; 3 1.1,0.85; 4 -1.1,0.85

### Placement (x,y rotation side)
BYP  8.76,35.43 270 top
C1  33.4,21.46 270 top
C2  35.56,25.84 270 top
C3  20.32,16 180 top
C4  10.16,28.7 0 top
C5  21.59,8.38 90 top
C6  20.32,24.89 0 top
C7  19.56,46.23 0 top
C8  27.94,31.88 0 top
C9  19.56,40.64 180 top
C10  1.78,32.13 180 top
C12  10.16,30.23 0 top
C15  10.67,33.02 180 top
C16  20.32,22.86 180 top
C17  19.56,39.12 0 top
C18  14.22,48.26 0 top
D1  16,10.92 90 top
D2  27.94,39.37 180 top
D3  27.94,35.56 180 top
F2  5.71,33.02 0 top
FD1  11.43,54.61 0 bottom
FD2  66.04,13.97 0 bottom
FRAME1  -5.08,-35.56 0 top  (outside the outline)
IC3  7.62,24.13 90 top
J1  22.86,1.27 0 top
J2  64.77,30.48 270 top
J3  2.03,11.18 0 top
J4  63.5,19.05 90 top
J5  6.35,41.91 270 top
JP1  37.47,41.02 0 top
JP2  18.8,53.34 0 top
JP3  13.97,5.08 0 top
JP4  66.04,10.16 0 top
JP5  66.04,38.1 0 top
JP6  15.24,53.34 0 top
JP7  39.12,43.56 0 top
JP8  66.04,13.97 0 top
JP9  11.43,54.61 0 top
JP10  45.72,5.08 180 top
JP11  63.5,53.34 180 top
JP12  18.8,57.15 0 top
JP13  50.8,5.08 0 top
JP14  1.91,41.91 0 bottom
JP15  45.72,1.27 180 top
JP18  50.8,1.27 0 top
JP19  63.5,57.15 180 top
LED1  27.94,43.31 0 top
LED2  58.04,38.23 0 top
LOGO1  61.72,19.05 90 top
Q1  6.35,29.46 270 top
Q2  59.44,19.05 90 top
Q3  55.88,19.05 270 top
QW1  60.96,12.7 0 bottom
QW2  57.15,12.7 0 bottom
R1  27.94,41.4 180 top
R2  58.04,36.58 0 top
R3  27.94,29.84 180 top
R4  3.81,29.34 270 top
R5  55.88,21.59 0 top
R6  55.88,16.51 0 top
R7  1.78,33.91 0 top
R8  10.79,48.26 180 top
R11  59.44,21.59 180 top
R12  27.94,33.66 180 top
R13  59.44,16.51 180 top
R14  13.34,19.81 180 top
R15  13.34,22.35 0 top
R16  27.94,37.47 180 top
S1  5.08,52.07 180 top
S2  27.94,17.78 0 top
TP1  66.04,33.02 0 bottom
TP2  66.04,30.48 0 bottom
TP3  66.04,27.94 0 bottom
TP4  63.5,33.02 0 bottom
TP5  63.5,30.48 0 bottom
TP6  63.5,27.94 0 bottom
U1  14.1,40.13 90 top
U3  20.32,20.32 270 top
U4  41.91,22.86 180 top
U$1  31.75,30.48 0 top
U$2  [_D#0]  6.1,42.8 0 bottom
U$3  62.87,40.26 0 bottom
U$4  [V0]  5.21,44.58 0 bottom
U$9  [10#0]  36.58,57.15 270 bottom
U$10  [G0]  5.21,39.24 0 bottom
U$11  [LOGIC0]  32.38,14.48 90 top
U$12  [D#0]  5.84,41.02 0 bottom
U$13  [_RESET0]  -0.76,48.39 0 top
U$14  [#BYP#0]  3.05,35.56 0 top
U$16  2.54,53.85 0 bottom
U$17  [7#15V0]  12.95,8 90 top
U$18  [_AREF0]  24,44.2 90 top
U$19  [_SCL0]  18.8,45.72 90 top
U$20  [_SDA0]  21.34,45.59 90 top
U$21  [11#0]  34.04,57.15 270 bottom
U$22  [130]  29.21,46.61 90 top
U$23  [120]  31.62,46.61 90 top
U$24  [#110]  34.16,45.47 90 top
U$25  [#100]  36.83,45.09 90 top
U$26  [#90]  39.24,46.35 90 top
U$27  [80]  41.78,47.75 90 top
U$28  [70]  45.47,47.75 90 top
U$29  [#60]  48.13,46.23 90 top
U$30  [#50]  50.55,46.35 90 top
U$31  [40]  53.09,47.75 90 top
U$32  [#30]  55.63,46.23 90 top
U$33  [20]  58.17,47.62 90 top
U$34  [10]  60.71,48.13 90 top
U$35  [00]  63.25,47.75 90 top
U$36  [TX0]  60.96,44.96 90 top
U$37  [RX0]  63.5,44.96 90 top
U$38  [DIGITAL_##PWM####_0]  37.85,46.48 0 top
U$39  [13_0]  21.59,43.18 0 top
U$40  [_TX0]  19.81,39.37 0 top
U$41  [_RX0]  20.32,35.56 0 top
U$42  [_GND0]  26.42,45.21 90 top
U$43  [3#3V0]  25.4,20.83 90 top
U$44  [5V0]  30.48,20.83 90 top
U$45  [ON0]  59.44,38.23 0 top
U$46  [ISP0]  61.72,25.4 0 top
U$47  [POWER0]  37.47,11.94 0 top
U$48  [ANALOG_IN0]  51.18,11.94 0 top
U$49  [IOREF0]  30.48,7.37 90 top
U$50  [RESET0]  33.15,7.37 90 top
U$51  [3#3V0]  35.56,7.37 90 top
U$52  [5V0]  38.1,7.37 90 top
U$53  [GND0]  40.64,7.37 90 top
U$54  [GND0]  43.18,7.37 90 top
U$55  [VIN0]  45.72,7.37 90 top
U$56  [A00]  50.8,7.49 90 top
U$57  [A10]  53.34,7.49 90 top
U$58  [A20]  55.88,7.49 90 top
U$59  [A30]  58.42,7.49 90 top
U$60  [A40]  60.96,7.49 90 top
U$61  [A50]  63.5,7.49 90 top
U$62  [A60]  22.86,1.91 90 top
U$63  [A70]  25.4,1.91 90 top
U$64  [00]  63.5,57.15 270 bottom
U$65  [10]  60.96,57.15 270 bottom
U$66  [20]  58.42,57.15 270 bottom
U$67  [3#0]  55.88,57.15 270 bottom
U$68  [40]  53.34,57.15 270 bottom
U$69  [5#0]  50.8,57.15 270 bottom
U$70  [6#0]  48.26,57.15 270 bottom
U$71  [70]  45.72,57.15 270 bottom
U$72  [80]  41.66,57.15 270 bottom
U$73  [9#0]  39.12,57.15 270 bottom
U$76  [120]  31.5,57.15 270 bottom
U$77  [130]  28.96,57.15 270 bottom
U$78  [SFE_LOGO_NAME_.3]  33.02,26.67 0 bottom
U$79  [AREF0]  23.88,57.15 270 bottom
U$80  [SDA0]  21.34,57.15 270 bottom
U$81  [SCL0]  18.8,57.15 270 bottom
U$82  [MADE_IN0]  64.14,38.61 0 bottom
U$83  [THE_USA0]  64.14,36.45 0 bottom
U$84  [_A40]  60.96,7.62 270 bottom
U$85  [_GND_0]  26.42,57.78 270 bottom
U$86  [_A30]  58.42,7.62 270 bottom
U$87  [_A20]  55.88,7.62 270 bottom
U$88  [_A10]  53.34,7.24 270 bottom
U$89  [_A00]  50.8,7.62 270 bottom
U$90  [_VIN0]  45.72,8.89 270 bottom
U$93  [_5V0]  38.1,7.62 270 bottom
U$94  [_3#3V0]  35.56,10.16 270 bottom
U$95  [_RESET0]  33.02,12.7 270 bottom
U$96  [_IOREF0]  30.48,11.81 270 bottom
U$97  [_A60]  22.86,7.62 270 bottom
U$98  [_A70]  25.4,7.62 270 bottom
U$99  [_GND_0]  40.64,9.53 270 bottom
U$100  [#PLUS#0]  45.59,40.51 0 top
U$101  [SFE_LOGO_FLAME_.2]  29.21,31.75 0 bottom
U$102  [_A50]  63.5,7.62 270 bottom
U$103  [#PLUS#0]  49.02,50.29 0 bottom
U$104  [ELECTRONICS0]  33.53,39.5 0 top
U$105  [#A4#0]  58.8,14.73 0 bottom
U$106  [#A5#0]  62.61,14.73 0 bottom
U$107  [_GND_0]  43.18,9.53 270 bottom
Y1  49.53,24.89 90 top
Y2  19.56,43.43 90 top

### Tracks (layer width: path | path; a pad name or v marks a point on that pad's centre or on a via)
3.3V  (via drill 0.38)
  Top 0.305: J4.2 61.98,18.55 61.83,18.4 Q2.1 59.96,18.4 59.44,18.92 59.44,19.81 58.59,20.66 R11.2 R5.2 56.73,20.54 55.9,19.7 Q3.1
  Top 0.508: 21.59,21.3 U3.5 | v24.13,22.86 24.77,22.86 25.44,22.18 S2.1 S2.4
  Top 0.762: JP10.5 JP15.5
  Top 0.813: JP10.5 35.56,10.16 v34.29,11.43 | C6.+ 21.72,23.75 21.17,23.2 C16.1 | C16.1 v24.13,22.86 | C16.1 21.17,22.01 21.59,21.59 21.59,21.3 | J4.2 65.54,18.55 v66.04,19.05
  Bottom 0.813: v24.13,22.86 24.13,13.72 26.42,11.43 v34.29,11.43 35.18,10.54 51.18,10.54 58.42,3.3 62.99,3.3 63.5,3.81 63.5,16.51 v66.04,19.05
5V  (via drill 0.38)
  Top 0.406: IC3.2 12.95,24.13 14.19,22.9 R15.2
  Top 0.508: 18.92,19.27 U3.3 | v31.75,5.08 31.75,12.32 30.44,13.63 S2.6 S2.3
  Top 0.762: v36.83,5.08 37.85,5.08 38.1,5.33 | JP10.4 JP15.4
  Top 0.813: JP10.4 38.1,5.33 38.1,4.57 JP10.4 | C3.+ 18.92,19.27 | v5.08,26.81 5.35,27.08 Q1.2 3.84,28.51 R4.2 | U3.3 17.59,19.37 17.27,19.68 v17.27,20.57 17.27,21.08 17.46,21.27 U3.1 | C4.1 9.31,27.85 8.26,26.8
  Bottom 0.762: v36.83,5.08 v31.75,5.08 31.37,5.08 18.67,17.78 18.67,19.18 v17.27,20.57
  Bottom 0.813: v17.27,20.57 11.68,20.57
  other vias: 2.54,24.27 5.08,21.73 2.54,22.36 2.54,26.17
  pour Bottom (isolate 0.305, no thermals): 0.89,32.51 10.79,32.51 10.79,22.86 12.7,20.95 12.7,20.32 0.89,20.32
  pour Top (isolate 0.305, no thermals): 0.89,20.32 0.89,27.3 11.43,27.3 11.43,20.32
!DTR!
  Top 0.254: C8.1 25.4,31.88 25.27,31.88 17.65,31.88 13.84,35.69 13.84,38.99 13.34,39.5 U1.13
!RESET  (via drill 0.38, 0.38 pad 0.51)
  Top 0.254: C8.2 R3.1 28.79,28.36 v29.21,27.94
  Top 0.305: v42.31,20.81 U4.29 42.31,17.38 43.81,15.88 51.44,15.88 v52.07,16.51 | v29.21,27.94 30.35,26.8 v32.38,26.8 32.38,9.4 33.02,8.76 JP10.6 JP15.6 | v25.27,42.8 25.27,43.43 18.67,50.04 14.73,50.04 10.79,53.98 S1.3 S1.4 | v55.88,24.13 59.69,27.94 J2.5
  Bottom 0.305: v42.31,20.81 42.31,23.73 39.24,26.8 v32.38,26.8 | v29.21,27.94 29.21,38.86 v25.27,42.8 | v52.07,16.51 52.07,20.32 v55.88,24.13 | TP6.P$1 J2.5
  other vias: 62.23,27.94
A0
  Top 0.305: U4.23 36.73,20.86 36.45,20.57 36.45,15.62 40.01,12.06 48.9,12.06 50.8,10.16 JP13.1 JP18.1
A1
  Top 0.254: JP13.2 53.34,3.43
  Top 0.305: U4.24 37.62,15.72 40.64,12.7 52.07,12.7 53.34,11.43 JP13.2 | 53.34,3.43 JP18.2
A2
  Top 0.305: U4.25 39.11,15.5 41.27,13.34 53.98,13.34 55.88,11.43 55.88,3.81 JP13.3 JP18.3
A3
  Top 0.254: JP13.4 58.42,3.43
  Top 0.305: U4.26 39.91,15.97 41.91,13.97 55.88,13.97 58.42,11.43 JP13.4 | 58.42,3.43 JP18.4
A4/SDA  (via drill 0.38)
  Top 0.254: JP2.2A JP2.2B
  Top 0.305: U4.27 40.71,16.44 42.55,14.61 59.05,14.61 60.96,12.7 60.96,10.16 | 60.96,10.16 60.96,5.21 | 60.96,5.21 JP13.5 JP18.5 | JP2.2B 21.34,49.78 v26.42,44.7 | v59.69,5.21 60.96,5.21 | v59.69,10.16 60.96,10.16 | JP12.2 JP2.2A
  Bottom 0.305: 53.34,12.19 38.73,12.19 30.73,20.19 30.73,40.39 v26.42,44.7 | v59.69,5.21 53.34,11.56 53.34,12.19 | v53.34,16.51 53.34,12.19 | QW2.1 57.66,10.92 58.42,10.16 v59.69,10.16
A5/SCL  (via drill 0.38)
  Top 0.254: 63.5,5.08 63.5,3.43 | JP2.1A 18.8,54.61 JP2.1B
  Top 0.305: U4.28 41.51,16.91 43.18,15.24 60.96,15.24 63.5,12.7 63.5,10.16 | 63.5,10.16 JP13.6 63.5,5.08 v62.23,5.08 | JP2.1B 19.05,51.44 19.05,50.93 v25.15,44.83 | v62.23,10.16 63.5,10.16 | JP12.1 18.8,54.61 | 63.5,3.43 JP18.6
  Bottom 0.305: v25.15,44.83 30.1,39.88 30.1,19.68 38.35,11.43 51.94,11.43 59.18,4.19 61.34,4.19 v62.23,5.08 | QW1.1 61.47,10.92 v62.23,10.16
A6  (via drill 0.38)
  Top 0.305: v34.29,24 34.35,24.06 U4.19 | v34.29,18.92 34.29,14.86 v33.27,13.84 | v26.16,13.21 v24,11.05
  Bottom 0.305: v34.29,24 v34.29,18.92 | v33.27,13.84 26.8,13.84 v26.16,13.21 | v24,11.05 22.86,9.91 J1.1
A7  (via drill 0.38)
  Top 0.305: U4.22 37.55,21.59 35.56,21.59 34.92,20.95 34.92,13.08 v34.67,12.83 | v27.43,12.57 v25.02,10.16
  Bottom 0.305: v34.67,12.83 34.42,12.57 v27.43,12.57 | v25.02,10.16 25.4,9.78 J1.2
AREF  (via drill 0.38)
  Top 0.254: JP2.3A JP2.3B
  Top 0.305: 33.4,23.26 U4.20 | v33.4,28.57 33.4,23.26 | C1.1 33.4,23.26 | JP2.3B 23.88,48.39 v26.67,45.59 | JP2.3A JP12.3
  Bottom 0.305: v26.67,45.59 33.4,38.86 v33.4,28.57
CC1
  Top 0.305: J5.A5 3.96,43.16 3.17,43.94 3.17,47.62 3.81,48.26 R8.2
CC2
  Top 0.305: J5.B5 4.35,40.16 3.43,39.24 3.43,36.23 2.63,35.43 R7.2
CIPO  (via drill 0.38, 0.38 pad 0.51)
  Top 0.254: JP2.6A JP2.6B
  Top 0.305: U4.16 39.11,28.2 v37.34,29.97 38.1,30.73 38.1,41.91 31.5,48.51 JP2.6B | JP2.6A JP12.6
  Bottom 0.305: v37.34,29.97 39.24,31.88 58.67,31.88 59.82,33.02 J2.1 TP4.P$1
  other vias: 62.23,33.02
COPI  (via drill 0.38, 0.38 pad 0.51)
  Top 0.254: JP2.7A JP2.7B
  Top 0.305: U4.15 39.91,28.67 v39.5,29.08 39.5,43.05 34.04,48.51 JP2.7B | JP2.7A JP12.7
  Bottom 0.305: v39.5,29.08 56.9,29.08 60.96,25.02 66.04,25.02 68.11,27.09 68.11,28.65 67.31,29.45 J2.4 TP2.P$1
  other vias: 67.31,30.48
D2
  Top 0.254: 58.42,54.99 JP11.3
  Top 0.305: JP11.3 58.42,46.99 52.32,40.89 52.32,22.48 48.41,18.57 U4.32 | 58.42,54.99 JP19.3
D3
  Top 0.254: JP11.4 55.88,52.07
  Top 0.305: 55.88,52.07 55.88,50.8 55.88,45.72 51.69,41.53 51.69,22.73 49.02,20.07 48.77,20.07 48.76,20.06 U4.1 | JP11.4 JP19.4
D4  (via drill 0.38)
  Top 0.254: 53.34,54.99 JP11.5
  Top 0.305: v46.99,28.07 46.99,40.64 53.34,46.99 JP11.5 | U4.2 43.94,20.86 v43.69,20.61 | 53.34,54.99 JP19.5
  Bottom 0.305: v43.69,20.61 46.99,23.91 v46.99,28.07
D5
  Top 0.254: JP11.6
  Top 0.305: U4.9 44.71,40.64 50.8,46.73 JP11.6 | JP11.6 JP19.6
D6
  Top 0.254: 48.26,46.26 JP11.7 48.26,54.99
  Top 0.305: U4.10 43.91,41.91 48.26,46.26 | 48.26,54.99 JP19.7
D7
  Top 0.254: JP11.8 45.72,52.07
  Top 0.305: U4.11 43.11,43.18 45.72,45.79 | JP11.8 JP19.8
  Top 0.356: 45.72,52.07 45.72,45.79
D8
  Top 0.254: JP2.10A JP2.10B
  Top 0.305: U4.12 42.31,47.86 41.66,48.51 JP2.10B | JP2.10A JP12.10
D9
  Top 0.254: JP2.9A JP2.9B
  Top 0.305: U4.13 41.51,46.12 39.12,48.51 JP2.9B | JP2.9A JP12.9
D10
  Top 0.254: JP2.8A JP2.8B
  Top 0.305: U4.14 40.71,44.38 36.58,48.51 JP2.8B | JP2.8A JP12.8
D+  (via drill 0.38)
  Top 0.305: J5.B6 7.48,41.16 8,40.64 v8,40.13 8.06,40.19 15.3,40.19 15.88,40.77 U1.5 | v8,42.67 7.49,42.16 J5.A6
  Bottom 0.305: v8,42.67 v8,40.13 7.11,41.02 JP14.D+
D-  (via drill 0.38)
  Top 0.305: J5.B7 5.2,42.66 4.83,42.29 v4.7,42.29 4.7,42.04 5.08,41.66 J5.A7 10.38,41.66 10.58,41.46 14.79,41.46 15.37,42.04 U1.6
  Bottom 0.305: JP14.D- 4.19,42.8 v4.7,42.29
GND  (via drill 0.38, 0.38 pad 0.51)
  Top 0.254: JP10.2 42.42,3.43 42.23,3.62 41.91,3.94 v41.91,5.08 | C9.2 18.71,40.09 18.92,39.88 20.19,39.88 20.41,39.66 C17.2
  Top 0.305: U4.3 47.17,21.66 v47.75,21.08 | JP10.3 42.04,3.43 42.23,3.62 | JP2.4A JP12.4 | JP14.GND 2.79,38.35 2.79,37.08 v1.27,35.56
  Top 0.508: 6.94,37.19 6.35,36.6 | 6.65,38.69 7.37,37.97
  Top 0.762: JP10.2 JP15.2 | JP10.3 JP15.3
  other vias: 5.08,52.07 64.77,41.91 40.64,20.32 27.69,53.34 43.43,23.5 49.53,27.94 35.69,27.94 1.27,7.62 29.21,46.99 67.31,24.13 17.78,22.86 17.4,17.78 67.31,27.94 6.73,36.7 13.97,32.38 15.24,35.56 12.7,29.21 8.89,52.07 35.56,17.78 39.37,22.35 7.62,46.35 20.32,20.32 22.86,20.32 22.86,21.72 22.86,18.54 20.32,18.41 17.14,24.89 16.26,48.26 3.81,3.81 3.81,7.62 1.14,3.56 21.59,3.81 64.77,15.24 66.8,17.78 44.45,5.08 39.37,5.08 35.56,22.48 34.29,25.15 1.91,39.24 7.24,37.97 7.49,37.08 7.24,45.59 8.38,45.47
  pour Top (isolate 0.305, rank 2): 0,58.42 68.58,58.42 68.58,0 0,0
  pour Bottom (isolate 0.305, rank 2): 0,58.42 68.58,58.42 68.58,0 0,0
INSERT  (via drill 0.38)
  Top 0.305: J3.P$4 5.45,5.48 v4.95,5.97 | Q1.1 4.04,30.41 R4.1 1.99,30.19 v0.89,29.08
  Bottom 0.305: v4.95,5.97 4.95,14.86 0.89,18.92 v0.89,29.08
LV_SCL
  Top 0.305: Q2.2 60.36,20.57 | 60.36,20.57 60.36,21.52 R11.1 | J4.4 60.38,20.55 60.36,20.57
LV_SDA
  Top 0.305: J4.3 64.51,19.55 64.77,19.81 64.77,22.35 64.26,22.86 55.75,22.86 55.03,22.14 R5.1 54.48,21.59 54.1,21.21 54.1,18.67 54.37,18.4 Q3.2
N$1
  Top 0.305: R1.2 27.09,41.87 26.44,42.52 LED1.A
N$2
  Top 0.356: R2.1 57.19,36.92 56.54,37.57 LED2.A
N$3
  Top 0.305: U4.7 47.28,24.86 48.44,23.69 Y1.1
N$4
  Top 0.305: U4.8 47.5,25.66 47.94,26.09 Y1.3
N$5
  Top 0.305: D2.A 29.44,38.12 R16.1
N$6
  Top 0.305: U1.4 17.66,39.5 18.04,39.12 C17.1
N$7  (via drill 0.38)
  Top 0.305: Q2.3 58.59,18.98 58.59,18.88 60.29,17.18 R13.1 60.96,16.51 v62.23,15.24
  Bottom 0.305: QW1.2 60.45,14.35 61.34,15.24 v62.23,15.24
N$8
  Top 0.305: U1.7 17.99,43.31 20.19,43.31 20.41,43.09 Y2.1 C9.1
N$9
  Top 0.305: D3.A 29.44,34.3 R12.1
N$10
  Top 0.305: U1.8 18.66,44.58 Y2.3 C7.1
N$15
  Top 0.305: IC3.1 11.61,21.82 12.14,22.35 R15.1
  Top 0.406: R14.2 R15.1
N$45  (via drill 0.38)
  Top 0.254: 55.03,17.36 54.99,17.4
  Top 0.305: v53.34,17.78 53.72,17.78 54.1,17.4 54.99,17.4 55.88,17.4 56.8,18.32 Q3.3 | R6.1 55.03,17.36
  Bottom 0.305: QW2.2 56.64,17.02 55.88,17.78 v53.34,17.78
PWRIN
  Top 0.813: J3.VIN0 2.03,15.75 4.32,13.46 8.51,13.46 13.2,8.77 D1.A
RX-I  (via drill 0.38)
  Top 0.254: 63.5,54.99 63.5,52.07
  Top 0.305: U4.30 43.11,17.85 44.45,16.51 48.13,16.51 53.59,21.97 53.59,39.24 63.5,49.15 JP11.1 63.5,52.07 63.5,53.34 v62.23,53.34 | 63.5,54.99 JP19.1 | D3.C 23.9,35.56 22.5,36.96 v21.59,36.96 U1.2
  Bottom 0.305: v21.59,36.96 21.59,48.26 27.56,54.23 61.34,54.23 v62.23,53.34
SCK  (via drill 0.38, 0.38 pad 0.51)
  Top 0.254: JP2.5B JP2.5A
  Top 0.305: U4.17 v37.62,27.46 36.32,28.75 36.32,30.48 36.83,30.99 36.83,41.4 | JP2.5B 28.96,49.78 36.83,41.91 36.83,41.4 | R1.1 36.83,41.4 | JP2.5A JP12.5
  Bottom 0.305: v37.62,27.46 37.62,28.6 39.5,30.48 J2.3 TP5.P$1
  other vias: 62.23,30.48
SHLD  (via drill 0.38)
  other vias: 2.41,45.59
  pour Bottom: 0,46.99 5.08,46.99 5.08,36.83 0,36.83
  pour Top: 0,46.99 5.08,46.99 5.08,36.83 0,36.83
TX-O  (via drill 0.38)
  Top 0.305: U4.31 43.91,17.81 44.45,17.27 48.01,17.27 52.96,22.23 52.96,40.26 60.96,48.26 JP11.2 | v59.69,53.34 60.96,53.34 JP11.2 | JP11.2 JP19.2 | D2.C v22.73,39.37 21.59,38.23 U1.3
  Bottom 0.305: v22.73,39.37 22.73,47.24 28.83,53.34 v59.69,53.34
USBVCC
  Top 0.254: BYP.2 8.76,34.82
  Top 0.813: F2.2 C15.+ | C15.+ 8.76,33.52 8.76,34.82 | Q1.3 7.87,29.46 8.64,30.23 | 8.64,30.23 C12.1 | C15.+ 9.27,30.86 8.64,30.23
VCC  (via drill 0.38)
  Top 0.254: v25.78,37.47 R16.2
  Top 0.305: v55.88,25.4 55.88,30.48 58.89,33.49 R2.2 63.12,36.58 64.77,34.92 64.77,33.78 65.53,33.02 J2.2 | R3.2 26.16,29.84 v25.59,30.42 25.53,30.35 18.16,30.35 v12.89,35.62 12.83,35.69 U1.16 | R6.2 57.66,16.51 | 57.66,16.51 R13.2 | v57.66,17.78 57.66,16.51 | C18.1 v13.37,46.86 | v25.78,33.66 R12.2
  Top 0.508: U4.6 44.52,24.06 44.07,24.51 42.29,24.51 41.91,24.13 | C2.2 35.69,24.86 U4.18 39.91,24.86 v40.64,24.13 41.91,24.13 | v47.77,22.46 U4.4 42.31,22.46 41.91,22.86 41.91,24.13 | v31.5,26.04 27.94,26.04 | R3.2 27.09,28.03 27.94,27.18 27.94,26.04 | 27.94,26.04 S2.2 S2.5 27.94,13.97 30.48,11.43 JP10.7 JP15.7
  Bottom 0.305: v47.77,22.46 52.94,22.46 v55.88,25.4 57.15,25.4 57.66,24.89 v57.66,17.78 | v25.78,37.47 v25.78,33.66 25.78,30.61 v25.59,30.42 | TP1.P$1 J2.2 | v13.37,46.86 13.37,36.11 v12.89,35.62
  Bottom 0.508: v40.64,24.13 38.73,26.04 v31.5,26.04
  other vias: 67.31,33.02
VIN  (via drill 0.38)
  Top 0.305: JP10.1 45.72,6.73
  Top 0.762: v29.2,9.13 24.38,9.13 22.73,10.78 C5.+ 17.16,10.78 16,11.94 D1.C 16,24.14 13.7,26.44 IC3.3 | JP10.1 JP15.1
  Top 0.813: v41.9,9.13 45.1,9.13 45.72,8.51 45.72,6.73
  Bottom 0.813: v41.9,9.13 v29.2,9.13
VUSB  (via drill 0.38)
  Top 0.254: 8.76,35.94 BYP.1 8.64,35.97
  Top 0.635: J5.VBUS2 7.4,39.46 v7.94,38.92 | J5.VBUS1 7.84,44.36
  Top 0.762: 7.84,44.36 v7.87,44.32 | C10.1 4.19,32.13 4.19,33 F2.1
  Top 0.813: F2.1 4.21,34.7 4.61,35.09 6.6,35.09 7.46,35.94 8.76,35.94 | v7.94,38.92 8.64,38.23 8.64,35.97
  Bottom 0.762: JP14.VBUS 3.56,44.58 4.32,43.81 7.87,43.81 | 9.14,42.8 8.13,43.81 7.87,43.81 | v7.87,44.32 7.87,43.81
  Bottom 0.813: 9.14,42.8 9.14,39.5 8.57,38.92 v7.94,38.92

### Text on the board
Bottom: v10
Measures: Units in inches
tDocu: Jim Lindblom / N. Seidle | Revised By: Priyanka Makin | Based on Arduino by: M.Banzi, D.Cuartielles, / T.Igoe, G.Martino, D.Mellis
214bmp: D:/SmartProjects/Snc/a4_bn_logo2.bmp